# EAGLE board Open-Source_Control_Unitary_V2_R1 (EAGLE 9.3.0), part 1 of 2
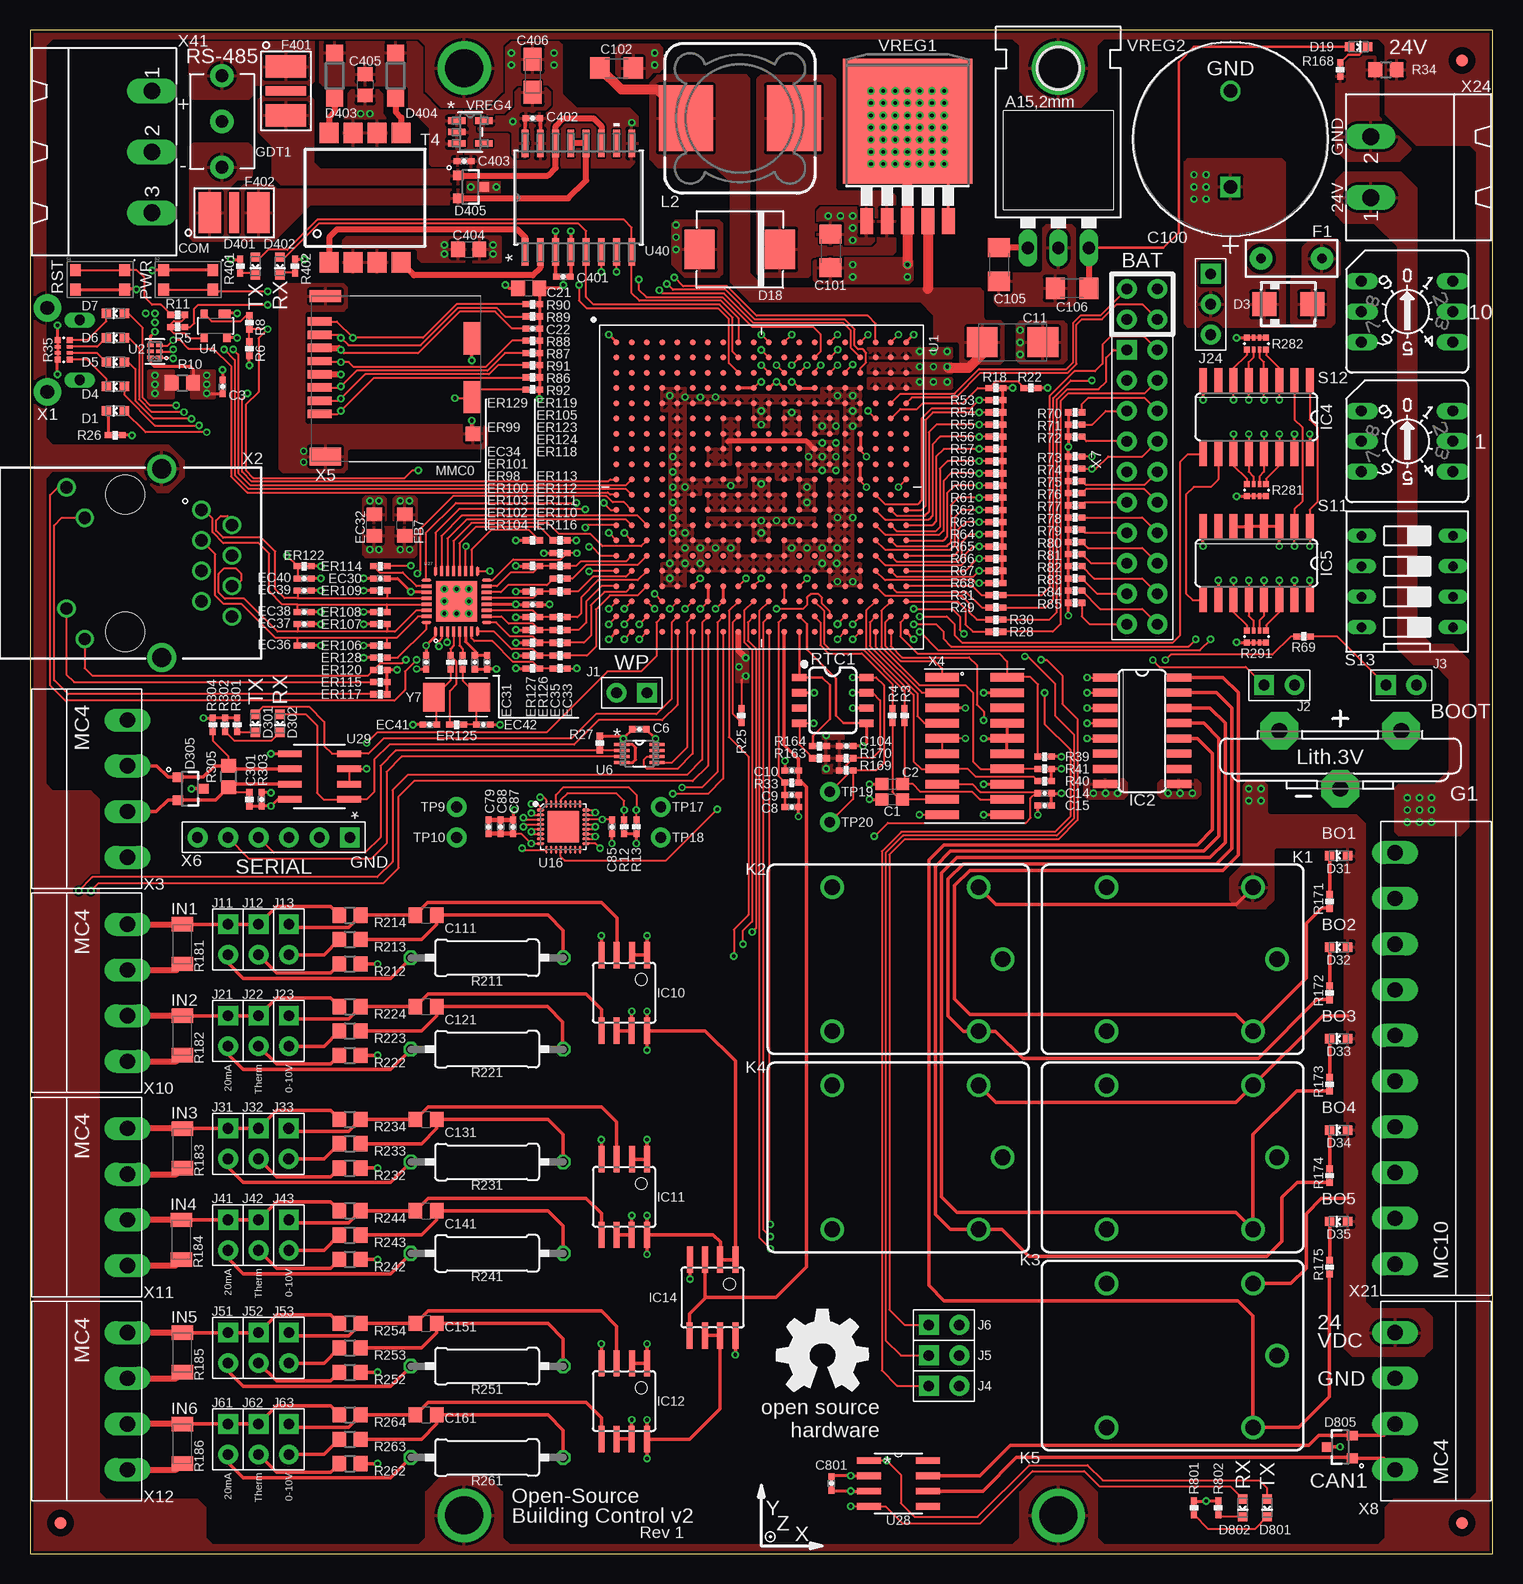
[diagram p7: board, top side]
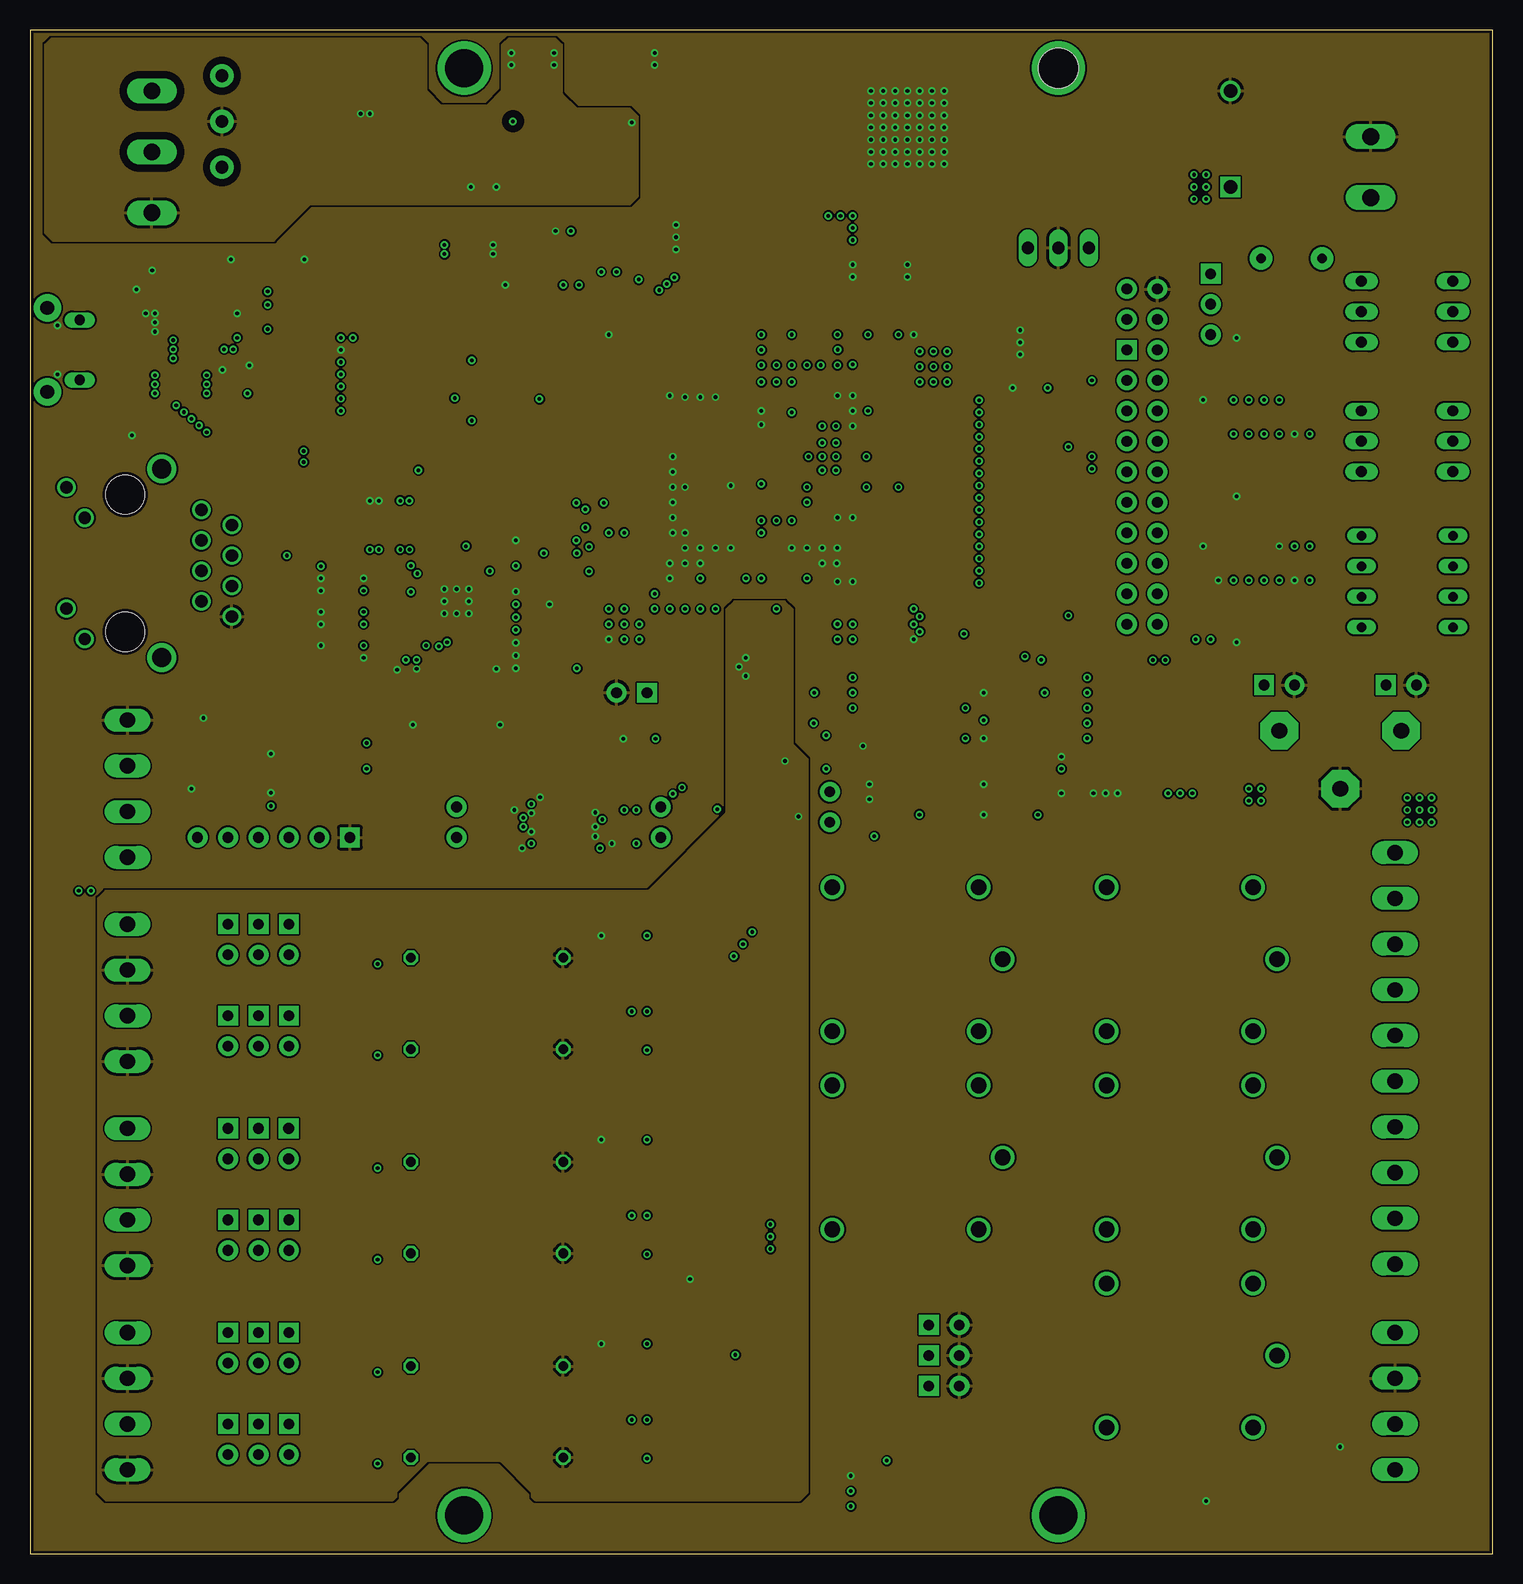
[diagram p8: board, inner layer Route2]
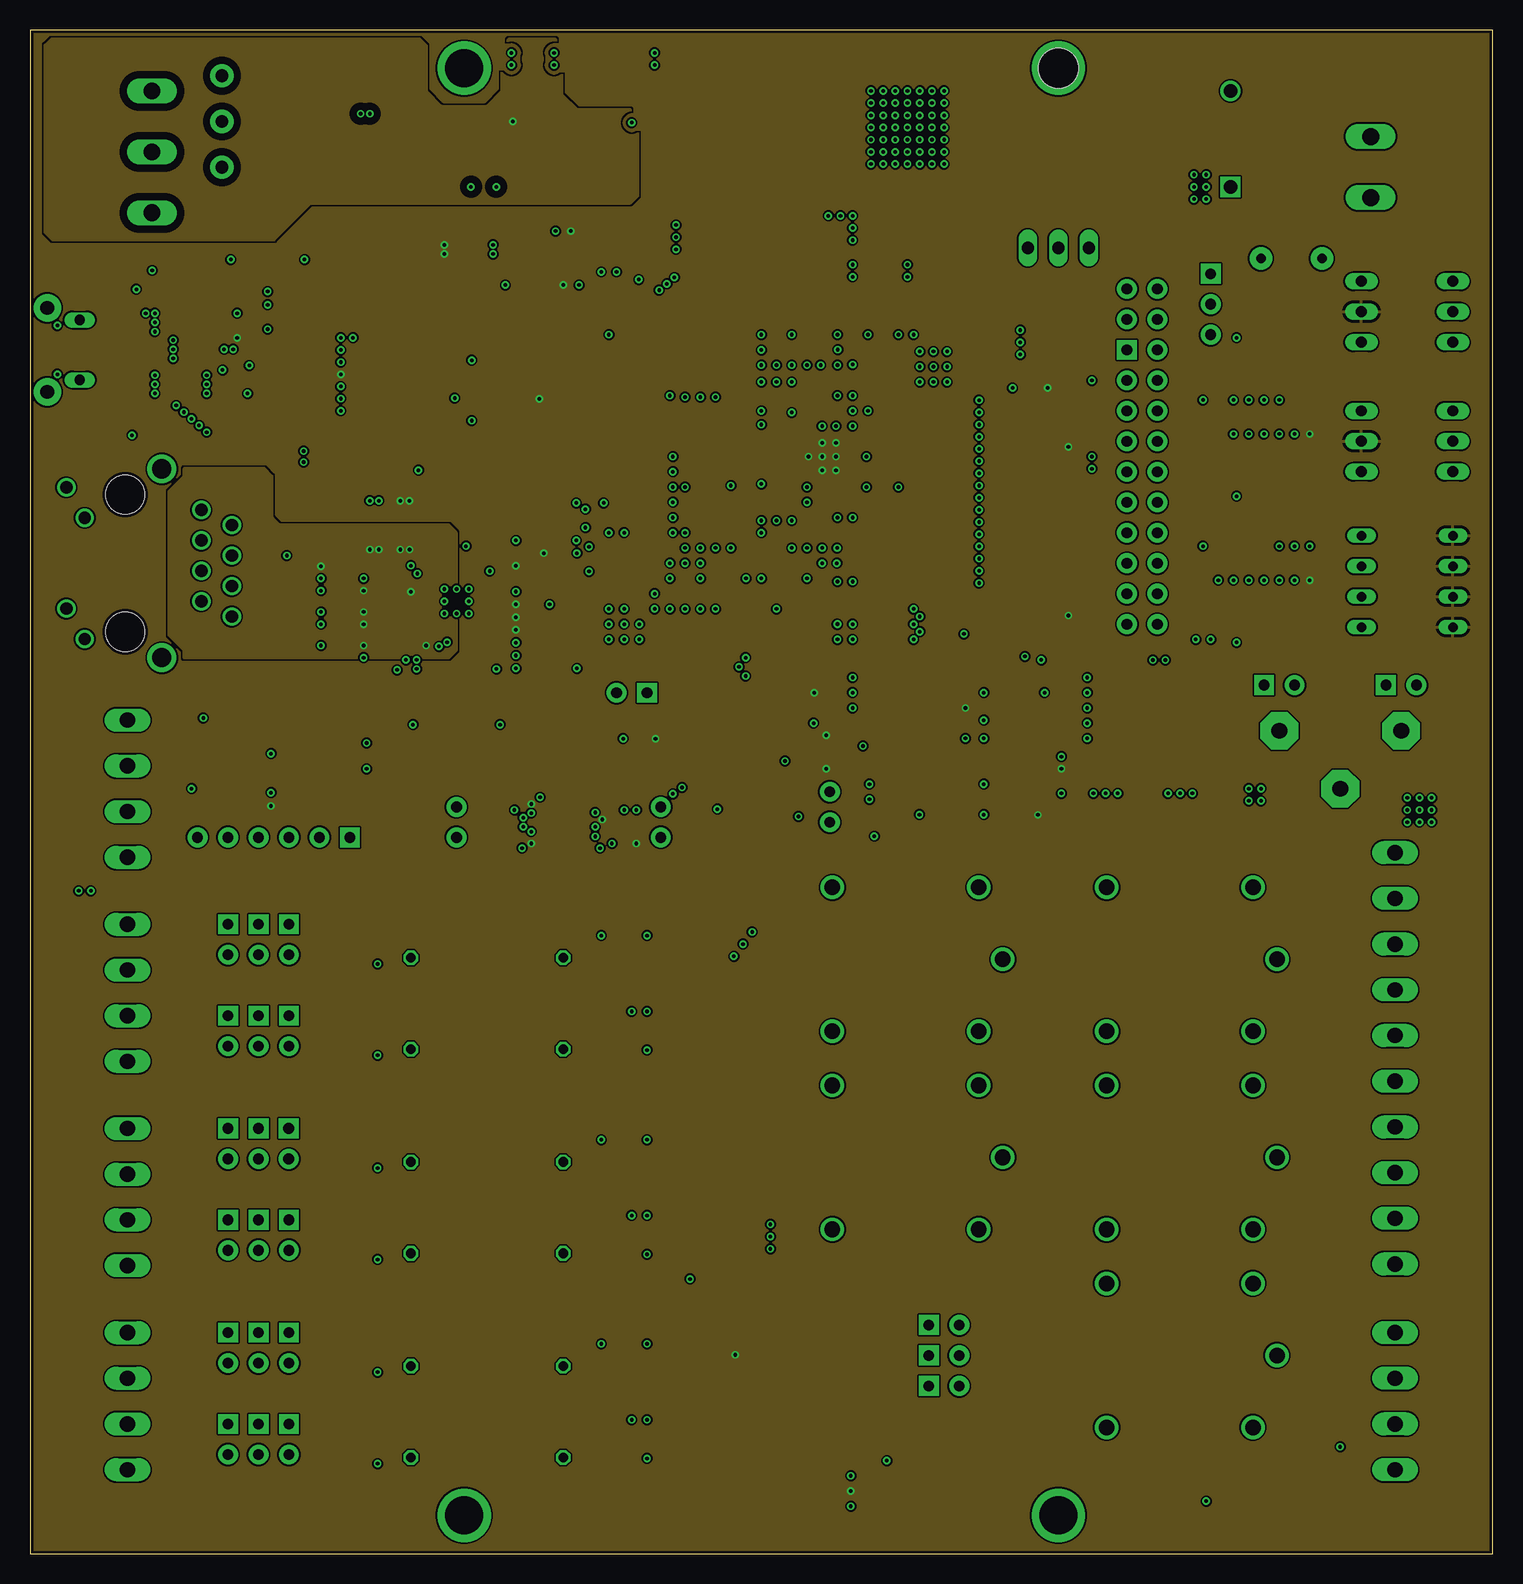
[diagram p9: board, inner layer Route15]
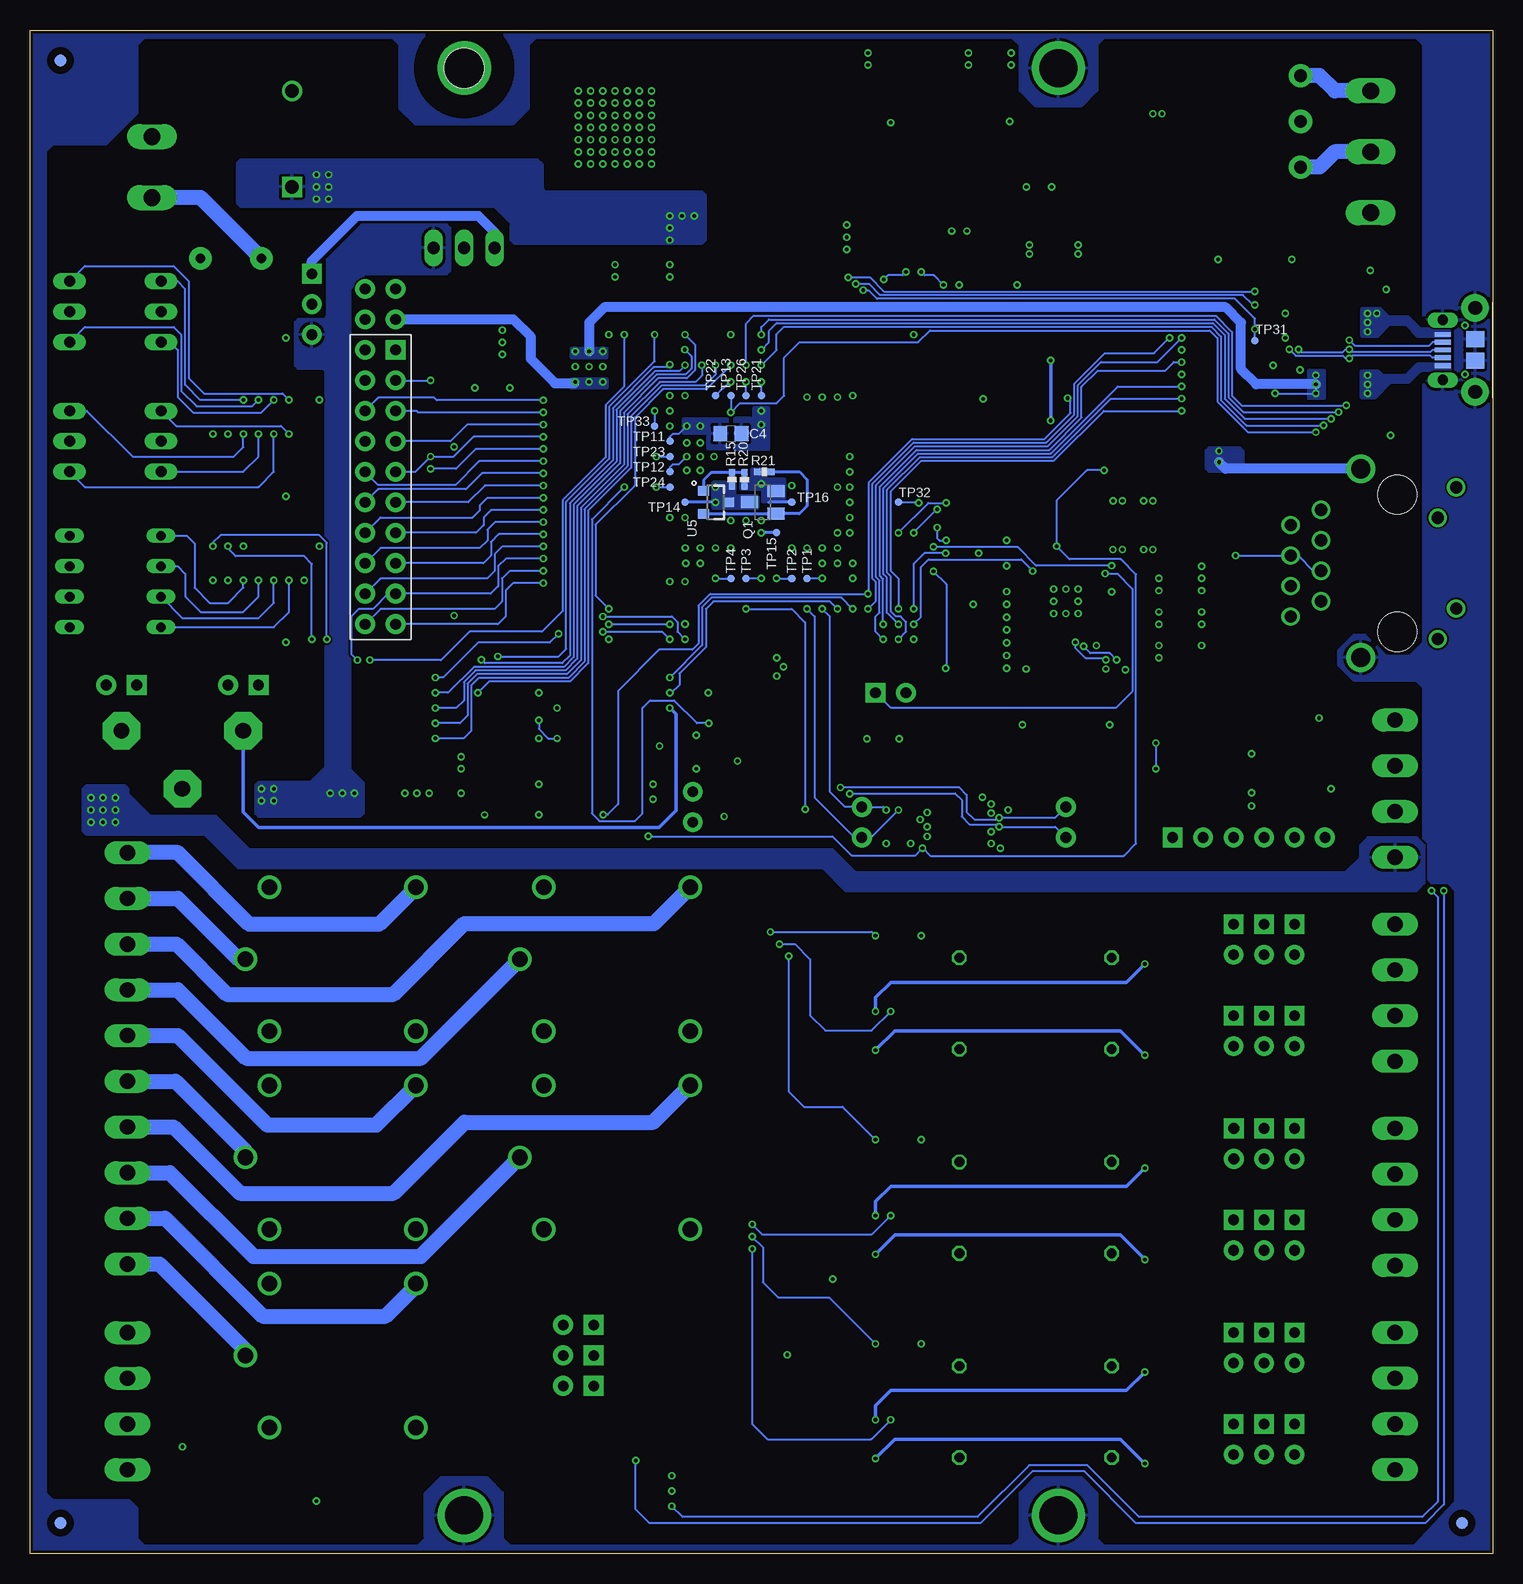
[diagram p10: board, bottom side, seen from below]

Size 121.92 x 127 mm. Coordinates in mm from the lower left corner, seen from the top.
Outline: 0,0 121.92,0 121.92,127 0,127 0,0
Copper layers (1*2*15*16): Top 0.035mm / dielectric 0.23mm / Route2 0.035mm / dielectric 0.93mm / Route15 0.035mm / dielectric 0.23mm / Bottom 0.035mm
Design rules "MF_Standard_4_Layer *": minimum track width 6mil, minimum drill 12mil, track to track 6mil, track to pad 6mil, pad to pad 6mil, via to via 6mil, smd to smd 0mil, copper to edge 10mil, drill to drill 10mil, minimum pad ring 6mil, minimum via ring 6mil, stop-mask expansion 2mil, vias tented up to drill 25mil, thermal gap 10mil
Net classes: 0 default: width 0.127 mm, drill 0.254 mm; 1 ground: width 0.152 mm, drill 0.254 mm, clearance 0.152 mm

## Footprints (pad centres in the part's own frame; a part is rotated, then mirrored left to right if it is on the bottom)
C0603 = smd 1.1 x 1: 1 -0.85,0; 2 0.85,0
C0402 = smd 0.61 x 0.508: 1 -0.559,0; 2 0.559,0
C0805 = smd 1.143 x 1.27: 1 -0.889,0; 2 0.889,0
C/6032-28R = smd 2.55 x 2.5: + 2.525,0; - -2.525,0
PCAP_16X25-THRU-ELECT = drill 1.118 pad 1.524 square: 1 -8.001,0 | drill 1.118 pad 1.524: 2 0,0
1206 = smd 1.6 x 1.8: 1 -1.4,0; 2 1.4,0
A/3216-18R = smd 1.95 x 1.5: + 1.375,0; - -1.375,0
EIA-STD = smd 0.787 x 0.787: 1 -0.749,0; 2 0.749,0
SMA = smd 2 x 2: A 2,0; C -2,0
SMC = smd 2.5 x 3.3: A 3.35,0; C -3.35,0
SOT23-3 = smd 0.8 x 0.9: 1 -0.95,-1; 2 0.95,-1; 3 0,1.1
SOD123 = smd 1.4 x 1.4: A 1.9,0; C -1.9,0
R0402 = smd 0.61 x 0.508: 1 -0.559,0; 2 0.559,0
PTH = drill 0.8 pad 1.88: P$1 -2.54,0; P$2 2.54,0
TBU-CA = smd 1.88 x 3.404: 1 -2.032,0; 3 2.032,0 | smd 0.813 x 3.404: 2 0,0
FIDUCIAL_40MIL = smd 1.016 x 1.016: P$1 0,0
CR2032V = drill 1.321 pad 3.15 octagon: + -2.54,-5.08; +@1 -2.54,5.08; - 2.286,0
2036-XX-B3 = drill 1.067 pad 1.93: 1 0,-3.81; 2 0,3.81; 3 0,0
SO16 = smd 0.66 x 2.032: 1 -4.445,-3.073; 2 -3.175,-3.073; 3 -1.905,-3.073; 4 -0.635,-3.073; 5 0.635,-3.073; 6 1.905,-3.073; 7 3.175,-3.073; 8 4.445,-3.073; 9 4.445,3.073; 10 3.175,3.073; 11 1.905,3.073; 12 0.635,3.073; 13 -0.635,3.073; 14 -1.905,3.073; 15 -3.175,3.073; 16 -4.445,3.073
SOIC8 = smd 0.5 x 2.2: 1 -1.905,-3.154; 2 -0.645,-3.154; 3 0.625,-3.154; 4 1.895,-3.154; 5 1.905,3.154; 6 0.635,3.154; 7 -0.635,3.154; 8 -1.905,3.154
H2-2.54 = drill 0.889 pad 1.651 square: 1 0,1.27 | drill 0.889 pad 1.651: 2 0,-1.27
H3-2.54 = drill 0.889 pad 1.651 square: 1 0,2.54 | drill 0.889 pad 1.651: 2 0,0; 3 0,-2.54
JS-M = drill 1.3: 1 6.7,6; 2 6.7,-6; C 8.7,0; NC -5.5,-6; NO -5.5,6
MSS1260 = smd 5.5 x 4.5: 1 0,4.5; 2 0,-4.5
MOUNTING_HOLE = drill 3.175 pad 4.445: P$1 0,0
SOT23-BEC = smd 1 x 1.4: B -0.95,-1.1; C 0,1.1; E 0.95,-1.1
R0805 = smd 1.143 x 1.27: 1 -0.889,0; 2 0.889,0
RN0804 = smd 0.498 x 0.5: 1 -0.801,-0.5; 4 0.801,-0.5; 5 0.801,0.5; 8 -0.801,0.5 | smd 0.3 x 0.5: 2 -0.25,-0.5; 3 0.25,-0.5; 6 0.25,0.5; 7 -0.25,0.5
CT/CN1206 = smd 1.2 x 1.8: 1 -1.65,0; 2 1.65,0
0309/12 = drill 0.813 octagon: 1 -6.35,0; 2 6.35,0
SO08 = smd 0.6 x 1.2: 1 -1.905,-2.8; 2 -0.635,-2.8; 3 0.635,-2.8; 4 1.905,-2.8; 5 1.905,2.8; 6 0.635,2.8; 7 -0.635,2.8; 8 -1.905,2.8
SW4SMD_63X161LS = smd 0.9 x 1: 1 2.05,0.8; 2 2.05,-0.8; 3 -2.05,0.8; 4 -2.05,-0.8
P101 = drill 0.914 long: 1 3.81,-2.54; 2 -3.81,2.54; 4 3.81,2.54; 8 -3.81,-2.54; C 3.81,0; C1 -3.81,0
DS-04 = drill 0.813 long: 1 -3.81,-3.81; 2 -1.27,-3.81; 3 1.27,-3.81; 4 3.81,-3.81; 5 3.81,3.81; 6 1.27,3.81; 7 -1.27,3.81; 8 -3.81,3.81
DA230X-AL = smd 1.7 x 1.6: P$1 -5.4,3; P$2 -5.4,1; P$3 -5.4,-1; P$4 -5.4,-3; P$5 5.4,-3; P$6 5.4,-1; P$7 5.4,1; P$8 5.4,3
TP_B0,65 = smd 0.635 x 0.635: TP 0,0
TESTPAD/W_HOLE_1X1 = drill 0.889 pad 1.651: P$1 0,0
OSD335X-BGA-400 = smd 0.5 x 0.5: A1 -12.065,-12.065; A2 -12.065,-10.795; A3 -12.065,-9.525; A4 -12.065,-8.255; A5 -12.065,-6.985; A6 -12.065,-5.715; A7 -12.065,-4.445; A8 -12.065,-3.175; A9 -12.065,-1.905; A10 -12.065,-0.635; A11 -12.065,0.635; A12 -12.065,1.905; A13 -12.065,3.175; A14 -12.065,4.445; A15 -12.065,5.715; A16 -12.065,6.985; A17 -12.065,8.255; A18 -12.065,9.525; A19 -12.065,10.795; A20 -12.065,12.065; B1 -10.795,-12.065; B2 -10.795,-10.795; B3 -10.795,-9.525; B4 -10.795,-8.255; B5 -10.795,-6.985; B6 -10.795,-5.715; B7 -10.795,-4.445; B8 -10.795,-3.175; B9 -10.795,-1.905; B10 -10.795,-0.635; B11 -10.795,0.635; B12 -10.795,1.905; B13 -10.795,3.175; B14 -10.795,4.445; B15 -10.795,5.715; B16 -10.795,6.985; B17 -10.795,8.255; B18 -10.795,9.525; B19 -10.795,10.795; B20 -10.795,12.065; C1 -9.525,-12.065; C2 -9.525,-10.795; C3 -9.525,-9.525; C4 -9.525,-8.255; C5 -9.525,-6.985; C6 -9.525,-5.715; C7 -9.525,-4.445; C8 -9.525,-3.175; C9 -9.525,-1.905; C10 -9.525,-0.635; C11 -9.525,0.635; C12 -9.525,1.905; C13 -9.525,3.175; C14 -9.525,4.445; C15 -9.525,5.715; C16 -9.525,6.985; C17 -9.525,8.255; C18 -9.525,9.525; C19 -9.525,10.795; C20 -9.525,12.065; D1 -8.255,-12.065; D2 -8.255,-10.795; D3 -8.255,-9.525; D4 -8.255,-8.255; D5 -8.255,-6.985; D6 -8.255,-5.715; D7 -8.255,-4.445; D8 -8.255,-3.175; D9 -8.255,-1.905; D10 -8.255,-0.635; D11 -8.255,0.635; D12 -8.255,1.905; D13 -8.255,3.175; D14 -8.255,4.445; D15 -8.255,5.715; D16 -8.255,6.985; D17 -8.255,8.255; D18 -8.255,9.525; D19 -8.255,10.795; D20 -8.255,12.065; E1 -6.985,-12.065; E2 -6.985,-10.795; E3 -6.985,-9.525; E4 -6.985,-8.255; E5 -6.985,-6.985; E6 -6.985,-5.715; E7 -6.985,-4.445; E8 -6.985,-3.175; E9 -6.985,-1.905; E10 -6.985,-0.635; E11 -6.985,0.635; E12 -6.985,1.905; E13 -6.985,3.175; E14 -6.985,4.445; E15 -6.985,5.715; E16 -6.985,6.985; E17 -6.985,8.255; E18 -6.985,9.525; E19 -6.985,10.795; E20 -6.985,12.065; F1 -5.715,-12.065; F2 -5.715,-10.795; F3 -5.715,-9.525; F4 -5.715,-8.255; F5 -5.715,-6.985; F6 -5.715,-5.715; F7 -5.715,-4.445; F8 -5.715,-3.175; F9 -5.715,-1.905; F10 -5.715,-0.635; F11 -5.715,0.635; F12 -5.715,1.905; F13 -5.715,3.175; F14 -5.715,4.445; F15 -5.715,5.715; F16 -5.715,6.985; F17 -5.715,8.255; F18 -5.715,9.525; F19 -5.715,10.795; F20 -5.715,12.065; G1 -4.445,-12.065; G2 -4.445,-10.795; G3 -4.445,-9.525; G4 -4.445,-8.255; G5 -4.445,-6.985; G6 -4.445,-5.715; G7 -4.445,-4.445; G8 -4.445,-3.175; G9 -4.445,-1.905; G10 -4.445,-0.635; G11 -4.445,0.635; G12 -4.445,1.905; G13 -4.445,3.175; G14 -4.445,4.445; G15 -4.445,5.715; G16 -4.445,6.985; G17 -4.445,8.255; G18 -4.445,9.525; G19 -4.445,10.795; G20 -4.445,12.065; H1 -3.175,-12.065; H2 -3.175,-10.795; H3 -3.175,-9.525; H4 -3.175,-8.255; H5 -3.175,-6.985; H6 -3.175,-5.715; H7 -3.175,-4.445; H8 -3.175,-3.175; H9 -3.175,-1.905; H10 -3.175,-0.635; H11 -3.175,0.635; H12 -3.175,1.905; H13 -3.175,3.175; H14 -3.175,4.445; H15 -3.175,5.715; H16 -3.175,6.985; H17 -3.175,8.255; H18 -3.175,9.525; H19 -3.175,10.795; H20 -3.175,12.065; J1 -1.905,-12.065; J2 -1.905,-10.795; J3 -1.905,-9.525; J4 -1.905,-8.255; J5 -1.905,-6.985; J6 -1.905,-5.715; J7 -1.905,-4.445; J8 -1.905,-3.175; J9 -1.905,-1.905; J10 -1.905,-0.635; J11 -1.905,0.635; J12 -1.905,1.905; J13 -1.905,3.175; J14 -1.905,4.445; J15 -1.905,5.715; J16 -1.905,6.985; J17 -1.905,8.255; J18 -1.905,9.525; J19 -1.905,10.795; J20 -1.905,12.065; K1 -0.635,-12.065; K2 -0.635,-10.795; K3 -0.635,-9.525; K4 -0.635,-8.255; K5 -0.635,-6.985; K6 -0.635,-5.715; K7 -0.635,-4.445; K8 -0.635,-3.175; K9 -0.635,-1.905; K10 -0.635,-0.635; K11 -0.635,0.635; K12 -0.635,1.905; K13 -0.635,3.175; K14 -0.635,4.445; K15 -0.635,5.715; K16 -0.635,6.985; K17 -0.635,8.255; K18 -0.635,9.525; K19 -0.635,10.795; K20 -0.635,12.065; L1 0.635,-12.065; L2 0.635,-10.795; L3 0.635,-9.525; L4 0.635,-8.255; L5 0.635,-6.985; L6 0.635,-5.715; L7 0.635,-4.445; L8 0.635,-3.175; L9 0.635,-1.905; L10 0.635,-0.635; L11 0.635,0.635; L12 0.635,1.905; L13 0.635,3.175; L14 0.635,4.445; L15 0.635,5.715; L16 0.635,6.985; L17 0.635,8.255; L18 0.635,9.525; L19 0.635,10.795; L20 0.635,12.065; M1 1.905,-12.065; M2 1.905,-10.795; M3 1.905,-9.525; M4 1.905,-8.255; M5 1.905,-6.985; M6 1.905,-5.715; M7 1.905,-4.445; M8 1.905,-3.175; M9 1.905,-1.905; M10 1.905,-0.635; M11 1.905,0.635; M12 1.905,1.905; M13 1.905,3.175; M14 1.905,4.445; M15 1.905,5.715; M16 1.905,6.985; M17 1.905,8.255; M18 1.905,9.525; M19 1.905,10.795; M20 1.905,12.065; N1 3.175,-12.065; N2 3.175,-10.795; N3 3.175,-9.525; N4 3.175,-8.255; N5 3.175,-6.985; N6 3.175,-5.715; N7 3.175,-4.445; N8 3.175,-3.175; N9 3.175,-1.905; N10 3.175,-0.635; N11 3.175,0.635; N12 3.175,1.905; N13 3.175,3.175; N14 3.175,4.445; N15 3.175,5.715; N16 3.175,6.985; N17 3.175,8.255; N18 3.175,9.525; N19 3.175,10.795; N20 3.175,12.065; P1 4.445,-12.065; P2 4.445,-10.795; P3 4.445,-9.525; P4 4.445,-8.255; P5 4.445,-6.985; P6 4.445,-5.715; P7 4.445,-4.445; P8 4.445,-3.175; P9 4.445,-1.905; P10 4.445,-0.635; P11 4.445,0.635; P12 4.445,1.905; P13 4.445,3.175; P14 4.445,4.445; P15 4.445,5.715; P16 4.445,6.985; P17 4.445,8.255; P18 4.445,9.525; P19 4.445,10.795; P20 4.445,12.065; R1 5.715,-12.065; R2 5.715,-10.795; R3 5.715,-9.525; R4 5.715,-8.255; R5 5.715,-6.985; R6 5.715,-5.715; R7 5.715,-4.445; R8 5.715,-3.175; R9 5.715,-1.905; R10 5.715,-0.635; R11 5.715,0.635; R12 5.715,1.905; R13 5.715,3.175; R14 5.715,4.445; R15 5.715,5.715; R16 5.715,6.985; R17 5.715,8.255; R18 5.715,9.525; R19 5.715,10.795; R20 5.715,12.065; T1 6.985,-12.065; T2 6.985,-10.795; T3 6.985,-9.525; T4 6.985,-8.255; T5 6.985,-6.985; T6 6.985,-5.715; T7 6.985,-4.445; T8 6.985,-3.175; T9 6.985,-1.905; T10 6.985,-0.635; T11 6.985,0.635; T12 6.985,1.905; T13 6.985,3.175; T14 6.985,4.445; T15 6.985,5.715; T16 6.985,6.985; T17 6.985,8.255; T18 6.985,9.525; T19 6.985,10.795; T20 6.985,12.065; U1 8.255,-12.065; U2 8.255,-10.795; U3 8.255,-9.525; U4 8.255,-8.255; U5 8.255,-6.985; U6 8.255,-5.715; U7 8.255,-4.445; U8 8.255,-3.175; U9 8.255,-1.905; U10 8.255,-0.635; U11 8.255,0.635; U12 8.255,1.905; U13 8.255,3.175; U14 8.255,4.445; U15 8.255,5.715; U16 8.255,6.985; U17 8.255,8.255; U18 8.255,9.525; U19 8.255,10.795; U20 8.255,12.065; V1 9.525,-12.065; V2 9.525,-10.795; V3 9.525,-9.525; V4 9.525,-8.255; V5 9.525,-6.985; V6 9.525,-5.715; V7 9.525,-4.445; V8 9.525,-3.175; V9 9.525,-1.905; V10 9.525,-0.635; V11 9.525,0.635; V12 9.525,1.905; V13 9.525,3.175; V14 9.525,4.445; V15 9.525,5.715; V16 9.525,6.985; V17 9.525,8.255; V18 9.525,9.525; V19 9.525,10.795; V20 9.525,12.065; W1 10.795,-12.065; W2 10.795,-10.795; W3 10.795,-9.525; W4 10.795,-8.255; W5 10.795,-6.985; W6 10.795,-5.715; W7 10.795,-4.445; W8 10.795,-3.175; W9 10.795,-1.905; W10 10.795,-0.635; W11 10.795,0.635; W12 10.795,1.905; W13 10.795,3.175; W14 10.795,4.445; W15 10.795,5.715; W16 10.795,6.985; W17 10.795,8.255; W18 10.795,9.525; W19 10.795,10.795; W20 10.795,12.065; Y1 12.065,-12.065; Y2 12.065,-10.795; Y3 12.065,-9.525; Y4 12.065,-8.255; Y5 12.065,-6.985; Y6 12.065,-5.715; Y7 12.065,-4.445; Y8 12.065,-3.175; Y9 12.065,-1.905; Y10 12.065,-0.635; Y11 12.065,0.635; Y12 12.065,1.905; Y13 12.065,3.175; Y14 12.065,4.445; Y15 12.065,5.715; Y16 12.065,6.985; Y17 12.065,8.255; Y18 12.065,9.525; Y19 12.065,10.795; Y20 12.065,12.065
DRY6 = smd 0.55 x 0.3: 1 -0.355,0.5 | smd 0.52 x 0.3: 2 -0.37,0; 3 -0.37,-0.5; 4 0.37,-0.5; 5 0.37,0; 6 0.37,0.5
SOT143-R = smd 1 x 0.7: 1 -0.75,-1 | smd 0.6 x 0.7: 2 0.95,-1; 3 0.95,1; 4 -0.95,1
DCU8 = smd 1.27 x 0.254: 1 -1.473,0.749; 2 -1.473,0.249; 3 -1.473,-0.249; 4 -1.473,-0.749; 5 1.473,-0.749; 6 1.473,-0.249; 7 1.473,0.249; 8 1.473,0.749
QFN32-0.4-4X4MM = smd 0.6 x 0.2: 1 -1.9,1.4; 2 -1.9,1; 3 -1.9,0.6; 4 -1.9,0.2; 5 -1.9,-0.2; 6 -1.9,-0.6; 7 -1.9,-1; 8 -1.9,-1.4; 17 1.9,-1.4; 18 1.9,-1; 19 1.9,-0.6; 20 1.9,-0.2; 21 1.9,0.2; 22 1.9,0.6; 23 1.9,1; 24 1.9,1.4 | smd 0.2 x 0.6: 9 -1.4,-1.9; 10 -1,-1.9; 11 -0.6,-1.9; 12 -0.2,-1.9; 13 0.2,-1.9; 14 0.6,-1.9; 15 1,-1.9; 16 1.4,-1.9; 25 1.4,1.9; 26 1,1.9; 27 0.6,1.9; 28 0.2,1.9; 29 -0.2,1.9; 30 -0.6,1.9; 31 -1,1.9; 32 -1.4,1.9 | smd 2.7 x 2.7: 33 0,0
LAN8710A-QFN32 = smd 0.254 x 0.838: 1 -1.751,-2.515; 2 -1.251,-2.515; 3 -0.751,-2.515; 4 -0.251,-2.515; 5 0.251,-2.515; 6 0.751,-2.515; 7 1.251,-2.515; 8 1.751,-2.515; 17 1.751,2.515; 18 1.251,2.515; 19 0.751,2.515; 20 0.251,2.515; 21 -0.251,2.515; 22 -0.751,2.515; 23 -1.251,2.515; 24 -1.751,2.515 | smd 0.838 x 0.254: 9 2.515,-1.751; 10 2.515,-1.251; 11 2.515,-0.751; 12 2.515,-0.251; 13 2.515,0.251; 14 2.515,0.751; 15 2.515,1.251; 16 2.515,1.751; 25 -2.515,1.751; 26 -2.515,1.251; 27 -2.515,0.751; 28 -2.515,0.251; 29 -2.515,-0.251; 30 -2.515,-0.751; 31 -2.515,-1.251; 32 -2.515,-1.751 | smd 3.404 x 3.404: 33 0,0
BEAGLEBONE_BLUE_D8 = smd 1.981 x 0.559: 1 -2.464,1.905; 2 -2.464,0.635; 3 -2.464,-0.635; 4 -2.464,-1.905; 5 2.464,-1.905; 6 2.464,-0.635; 7 2.464,0.635; 8 2.464,1.905
21-0041B_8 = smd 1.981 x 0.533: 1 -2.464,1.905; 2 -2.464,0.635; 3 -2.464,-0.635; 4 -2.464,-1.905; 5 2.464,-1.905; 6 2.464,-0.635; 7 2.464,0.635; 8 2.464,1.905
DW16 = smd 2.311 x 0.559: 1 -4.521,4.445; 2 -4.521,3.175; 3 -4.521,1.905; 4 -4.521,0.635; 5 -4.521,-0.635; 6 -4.521,-1.905; 7 -4.521,-3.175; 8 -4.521,-4.445; 9 4.521,-4.445; 10 4.521,-3.175; 11 4.521,-1.905; 12 4.521,-0.635; 13 4.521,0.635; 14 4.521,1.905; 15 4.521,3.175; 16 4.521,4.445
TO263-5 = smd 1.067 x 2.159: 1 -3.404,-5.791; 2 -1.702,-5.791; 3 0,-5.791; 4 1.702,-5.791; 5 3.404,-5.791 | smd 10.8 x 10.41: 6 0,2.54
78XXL = drill 1.016 long: GND 0,-3.81; IN -2.54,-3.81; OUT 2.54,-3.81 | hole 3.302: 0,11.176
DBV5 = smd 1.473 x 0.559: 1 -1.118,0.95; 2 -1.118,0; 3 -1.118,-0.95; 4 1.118,-0.95; 5 1.118,0.95
10118194-0001LF(MICRO-USB-B-AMPHENOL-FCI) = drill 1.15 pad 2.286: CGND1 0,3.5; CGND4 0,-3.5 | smd 1.5 x 1.35: CGND2 0,0.9; CGND3 0,-0.9 | drill 0.85 long: CGND5 2.7,-2.5; CGND6 2.7,2.5 | smd 1.35 x 0.4: D+ 2.7,0; D- 2.7,0.65; GND 2.7,-1.3; ID 2.7,-0.65; VBUS 2.7,1.3
J0011D01BNL = drill 1.016 pad 1.524: 1 4.445,-6.413; 2 3.175,-8.954; 3 1.905,-6.413; 4 0.635,-8.954; 5 -0.635,-6.413; 6 -1.905,-8.954; 7 -3.175,-6.413; 8 -4.445,-8.954; 9 6.325,4.839; 10 3.785,3.315; 11 -3.785,4.839; 12 -6.325,3.315 | drill 1.6 pad 2.286: S1 -7.874,-3.111; S2 7.874,-3.111 | hole 3.251: -5.715,-0.064; 5.715,-0.064
MC4 = drill 1.27 long: 1 -5.715,0; 2 -1.905,0; 3 1.905,0; 4 5.715,0
CTI-JTAG = smd 2.794 x 0.711: 1 -2.705,5.715; 2 2.705,5.715; 3 -2.705,4.445; 4 2.705,4.445; 5 -2.705,3.175; 6 2.705,3.175; 7 -2.705,1.905; 8 2.705,1.905; 9 -2.705,0.635; 10 2.705,0.635; 11 -2.705,-0.635; 12 2.705,-0.635; 13 -2.705,-1.905; 14 2.705,-1.905; 15 -2.705,-3.175; 16 2.705,-3.175; 17 -2.705,-4.445; 18 2.705,-4.445; 19 -2.705,-5.715; 20 2.705,-5.715
DM3CS-SF = smd 0.7 x 2: 1 0,0; 2 -1.1,0; 3 -2.2,0; 4 -3.3,0; 5 -4.4,0; 6 -5.5,0; 7 -6.6,0; 8 -7.7,0 | smd 1 x 2.6: 9 -9.8,0.5 | smd 1.5 x 2.6: 10 3.55,0.5 | smd 1.2 x 1.2: 11 1.65,12.8 | smd 2.7 x 1.4: 12 -1.4,12.7; 13 -6.3,12.7
H6-2.54 = drill 0.889 pad 1.651 square: 1 0,6.35 | drill 0.889 pad 1.651: 2 0,3.81; 3 0,1.27; 4 0,-1.27; 5 0,-3.81; 6 0,-6.35
H2X10-2.54 = drill 0.889 pad 1.651 square: 1 -1.27,11.43 | drill 0.889 pad 1.651: 2 1.27,11.43; 3 -1.27,8.89; 4 1.27,8.89; 5 -1.27,6.35; 6 1.27,6.35; 7 -1.27,3.81; 8 1.27,3.81; 9 -1.27,1.27; 10 1.27,1.27; 11 -1.27,-1.27; 12 1.27,-1.27; 13 -1.27,-3.81; 14 1.27,-3.81; 15 -1.27,-6.35; 16 1.27,-6.35; 17 -1.27,-8.89; 18 1.27,-8.89; 19 -1.27,-11.43; 20 1.27,-11.43
MC10 = drill 1.27 long: 1 -17.145,0; 2 -13.335,0; 3 -9.525,0; 4 -5.715,0; 5 -1.905,0; 6 1.905,0; 7 5.715,0; 8 9.525,0; 9 13.335,0; 10 17.145,0
MSTBA2 = drill 1.397 long: 1 -2.54,5.08; 2 2.54,5.08
MSTBA3 = drill 1.397 long: 1 -5.08,5.08; 2 0,5.08; 3 5.08,5.08
CRYSTAL-TXC-7A = smd 1.788 x 2.413: P$1 1.9,0; P$2 -1.9,0

## Placement (x,y rotation side)
C1  DNI  [C0603]  71.88,62.87 0 top
C2  DNI  [C0603]  71.88,64.14 0 top
C3  0.1uF, 6.3V  [C0402]  16.05,97.26 90 top
C4  47uF  [C0805]  63.5,93.34 0 bottom
C6  0.1uF, 6.3V  [C0402]  50.8,68.71 0 top
C8  1nF  [C0402]  63.5,62.23 0 top
C9  0.1uF, 6.3V  [C0402]  63.5,63.25 0 top
C10  0.1uF, 6.3V  [C0402]  63.5,65.28 180 top
C11  220uF, 6.3V, T491C227K006AT  [C/6032-28R]  81.92,100.97 180 top
C14  0.1uF, 6.3V  [C0402]  84.58,63.37 0 top
C15  0.1uF, 6.3V  [C0402]  84.58,62.36 0 top
C21  10uF, 10V  [C0805]  41.58,105.46 180 top
C22  0.1uF, 6.3V  [C0402]  41.91,102.11 180 top
C79  0.1uF, 6.3V  [C0402]  38.23,60.58 90 top
C85  2200pF, 6.3V  [C0402]  48.51,60.58 270 top
C87  2200pF, 6.3V  [C0402]  40.26,60.58 90 top
C88  2200pF, 6.3V  [C0402]  39.24,60.58 90 top
C100  1000uF, 50V, UHE1H102MHD6  [PCAP_16X25-THRU-ELECT]  100.08,121.92 90 top
C101  0.47uF, 100V, X7R  [1206]  66.73,108.58 270 top
C102  0.47uF, 100V, X7R  [1206]  48.9,123.83 0 top
C104  0.1uF, 6.3V  [C0402]  68.05,67.31 0 top
C105  0.47uF, 100V, X7R  [1206]  80.77,107.44 270 top
C106  0.1uF, 50V  [1206]  86.87,105.46 180 top
C111  1uF  [C0805]  33.02,53.21 0 top
C121  1uF  [C0805]  33.02,45.59 0 top
C131  1uF  [C0805]  33.02,36.2 0 top
C141  1uF  [C0805]  33.02,28.57 0 top
C151  1uF  [C0805]  33.02,19.18 0 top
C161  1uF  [C0805]  33.02,11.56 0 top
C301  0.1uF, 6.3V  [C0402]  19.3,62.87 90 top
C401  0.1uF, 16V  [C0402]  44.45,106.43 180 top
C402  0.1uF, 16V  [C0402]  41.91,119.63 0 top
C403  0.1uF, 16V  [C0402]  36.2,116.08 0 top
C404  10uF, 16V  [C0805]  36.58,108.71 0 top
C405  10uF, 16V  [C0805]  27.94,122.43 270 top
C406  4.7uF, 16V, T491A475K016AT  [A/3216-18R]  41.91,123.19 270 top
C801  0.1uF, 6.3V  [C0402]  66.8,5.84 90 top
D1  LTST-C191KFKT  [EIA-STD]  7.11,95.25 180 top
D3  S1D  [SMA]  104.88,104.14 0 top
D4  LTST-C191KGKT  [EIA-STD]  7.11,97.28 180 top
D5  LTST-C191KGKT  [EIA-STD]  7.11,99.31 180 top
D6  LTST-C191KGKT  [EIA-STD]  7.11,101.35 180 top
D7  LTST-C191KGKT  [EIA-STD]  7.11,103.38 180 top
D18  B550C-13-F  [SMC]  59.18,108.71 180 top
D19  LTST-C191KRKT  [EIA-STD]  110.74,125.6 0 top
D31  LTST-C191KRKT  [EIA-STD]  109.09,58.17 180 top
D32  LTST-C191KRKT  [EIA-STD]  109.09,50.55 180 top
D33  LTST-C191KRKT  [EIA-STD]  109.09,42.93 180 top
D34  LTST-C191KRKT  [EIA-STD]  109.09,35.31 180 top
D35  LTST-C191KRKT  [EIA-STD]  109.09,27.69 180 top
D301  LTST-C191KGKT  [EIA-STD]  18.8,69.22 270 top
D302  LTST-C191KFKT  [EIA-STD]  20.83,69.22 270 top
D305  SM712  [SOT23-3]  13.34,63.75 270 top
D401  LTST-C191KGKT  [EIA-STD]  18.8,107.31 270 top
D402  LTST-C191KFKT  [EIA-STD]  20.83,107.31 270 top
D403  MBR0520LT  [SOD123]  25.4,123.19 270 top
D404  MBR0520LT  [SOD123]  30.48,123.19 270 top
D405  SM712  [SOT23-3]  36.7,113.92 270 top
D801  LTST-C191KFKT  [EIA-STD]  103.12,3.81 270 top
D802  LTST-C191KGKT  [EIA-STD]  101.09,3.81 270 top
D805  CDSOT23-T24CAN  [SOT23-3]  109.22,8.89 90 top
EC30  0.1uF, 6.3V  [C0402]  29.21,81.28 180 top
EC31  0.1uF, 6.3V  [C0402]  33.02,74.3 270 top
EC32  10uF, 10V  [C0805]  28.7,85.72 90 top
EC33  1uF, 10V  [C0402]  38.1,74.3 270 top
EC34  0.1uF, 6.3V  [C0402]  41.91,79.12 0 top
EC35  470pF, 6.3V  [C0402]  37.08,74.3 270 top
EC36  15pF, DNI  [C0402]  22.86,75.69 0 top
EC37  15pF, DNI  [C0402]  22.86,77.47 0 top
EC38  15pF, DNI  [C0402]  22.86,78.49 0 top
EC39  15pF, DNI  [C0402]  22.86,80.26 0 top
EC40  0.022uF, 10V  [C0402]  22.86,81.28 0 top
EC41  30pF, 50V  [C0402]  33.32,69.09 180 top
EC42  30pF, 50V  [C0402]  37.8,69.09 0 top
ER98  1.5K, 1%  [R0402]  41.91,78.05 0 top
ER99  1.5K, 1%  [R0402]  41.91,82.32 0 top
ER100  1.5K, 1%  [R0402]  41.91,76.99 0 top
ER101  10K, 1%  [R0402]  41.91,80.19 180 top
ER102  10K, 1%  [R0402]  41.91,74.85 180 top
ER103  10K, 1%  [R0402]  41.91,75.92 180 top
ER104  10K, 1%  [R0402]  41.91,73.79 180 top
ER105  1.5K, 1%  [R0402]  44.2,83.39 0 top
ER106  49.9, 1%  [R0402]  29.21,75.69 0 top
ER107  49.9, 1%  [R0402]  29.21,77.47 0 top
ER108  49.9, 1%  [R0402]  29.21,78.49 0 top
ER109  49.9, 1%  [R0402]  29.21,80.26 0 top
ER110  100, 1%  [R0402]  44.2,74.85 0 top
ER111  100, 1%  [R0402]  44.2,75.92 0 top
ER112  100, 1%  [R0402]  44.2,76.99 0 top
ER113  100, 1%  [R0402]  44.2,78.05 0 top
ER114  100, 1%  [R0402]  29.21,82.3 0 top
ER115  470, 1%  [R0402]  29.21,72.64 180 top
ER116  100, 1%  [R0402]  44.2,73.79 0 top
ER117  470, 1%  [R0402]  29.21,71.63 180 top
ER118  100, 1%  [R0402]  44.2,80.19 0 top
ER119  100, 1%  [R0402]  44.2,84.45 0 top
ER120  10K, 1%  [R0402]  29.21,73.66 180 top
ER122  0, 1%  [R0402]  22.86,82.3 180 top
ER123  100, 1%  [R0402]  44.2,82.32 0 top
ER124  100, 1%  [R0402]  44.2,81.25 0 top
ER125  1M, 1%, DNI  [R0402]  35.56,69.09 0 top
ER126  0, 1%  [R0402]  36.07,74.3 270 top
ER127  10, 1%  [R0402]  35.05,74.3 270 top
ER128  12.1K, 1%  [R0402]  29.21,74.68 0 top
ER129  10K, 1%  [R0402]  41.91,84.45 180 top
F1  60V, 750mA, R075  [PTH]  105.16,107.95 0 top
F401  TBU-CA085-300-WH  [TBU-CA]  21.34,121.92 270 top
F402  TBU-CA085-300-WH  [TBU-CA]  17.02,111.76 0 top
FB7  150ohm, 800mA  [C0805]  31.24,85.72 270 top
FUD1  FIDUCIAL  [FIDUCIAL_40MIL]  119.38,2.54 0 top
FUD2  FIDUCIAL  [FIDUCIAL_40MIL]  119.38,124.46 0 top
FUD3  FIDUCIAL  [FIDUCIAL_40MIL]  2.54,2.54 0 top
FUD4  FIDUCIAL  [FIDUCIAL_40MIL]  119.38,124.46 90 bottom
FUD5  FIDUCIAL  [FIDUCIAL_40MIL]  2.54,2.54 90 bottom
FUD6  FIDUCIAL  [FIDUCIAL_40MIL]  119.38,2.54 90 bottom
G1  CR2032V  [CR2032V]  109.22,66.04 270 top
GDT1  2036-07-B3  [2036-XX-B3]  16,119.38 0 top
IC2  ULN2003AD  [SO16]  92.71,68.58 270 top
IC4  74HC165D  [SO16]  102.23,94.74 180 top
IC5  74HC165D  [SO16]  102.23,82.55 180 top
IC10  MCP6002SMT  [SOIC8]  49.53,46.74 180 top
IC11  MCP6002SMT  [SOIC8]  49.53,29.72 180 top
IC12  MCP6002SMT  [SOIC8]  49.53,12.7 180 top
IC14  MCP6002SMT  [SOIC8]  56.9,21.34 180 top
J1  [H2-2.54]  50.16,71.75 270 top
J2  [H2-2.54]  104.14,72.39 90 top
J3  [H2-2.54]  114.3,72.39 90 top
J4  [H2-2.54]  76.2,13.97 90 top
J5  [H2-2.54]  76.2,16.51 90 top
J6  [H2-2.54]  76.2,19.05 90 top
J11  [H2-2.54]  16.51,51.18 0 top
J12  [H2-2.54]  19.05,51.18 0 top
J13  [H2-2.54]  21.59,51.18 0 top
J21  [H2-2.54]  16.51,43.56 0 top
J22  [H2-2.54]  19.05,43.56 0 top
J23  [H2-2.54]  21.59,43.56 0 top
J24  6p-2.54  [H3-2.54]  98.42,104.14 0 top
J31  [H2-2.54]  16.51,34.16 0 top
J32  [H2-2.54]  19.05,34.16 0 top
J33  [H2-2.54]  21.56,34.16 0 top
J41  [H2-2.54]  16.51,26.54 0 top
J42  [H2-2.54]  19.05,26.54 0 top
J43  [H2-2.54]  21.59,26.54 0 top
J51  [H2-2.54]  16.51,17.14 0 top
J52  [H2-2.54]  19.05,17.14 0 top
J53  [H2-2.54]  21.59,17.14 0 top
J61  [H2-2.54]  16.51,9.53 0 top
J62  [H2-2.54]  19.05,9.53 0 top
J63  [H2-2.54]  21.59,9.53 0 top
K1  JS1-24V-F  [JS-M]  95.25,49.53 0 top
K2  JS1-24V-F  [JS-M]  72.39,49.53 0 top
K3  JS1-24V-F  [JS-M]  95.25,33.02 0 top
K4  JS1-24V-F  [JS-M]  72.39,33.02 0 top
K5  JS1-24V-F  [JS-M]  95.25,16.51 0 top
L2  MSS1260T-473ML  [MSS1260]  59.18,119.63 270 top
MGT1  MOUNTING_HOLE  [MOUNTING_HOLE]  36.2,3.17 0 top
MGT2  MOUNTING_HOLE  [MOUNTING_HOLE]  85.72,3.17 0 top
MGT3  MOUNTING_HOLE  [MOUNTING_HOLE]  36.2,123.83 0 top
MGT4  MOUNTING_HOLE  [MOUNTING_HOLE]  85.72,123.83 0 top
Q1  MMBT2907  [SOT23-BEC]  60.83,87.63 90 bottom
R3  0, 1%  [R0402]  72.9,69.85 270 top
R4  0, 1%  [R0402]  71.88,69.85 270 top
R5  0  [R0402]  12.32,102.23 180 top
R6  100K, DNI  [R0402]  18.29,100.43 90 top
R8  1K  [R0402]  18.29,102.62 90 top
R10  0, 1%  [R0805]  12.7,97.59 0 top
R11  0  [R0402]  12.32,103.25 0 top
R12  1.5K, 1%  [R0402]  49.53,60.58 270 top
R13  1.5K, 1%  [R0402]  50.55,60.58 270 top
R15  40.2K  [R0402]  63.4,89.53 90 bottom
R18  4.75K, 1%  [R0402]  80.52,97.16 180 top
R20  10K  [R0402]  62.36,89.53 270 bottom
R21  499  [R0402]  60.71,90.17 180 bottom
R22  4.75K, 1%  [R0402]  83.44,97.16 0 top
R25  0, 1%  [R0402]  59.31,69.85 90 top
R26  1.5K, 1%  [R0402]  7.11,93.22 0 top
R27  100K, 1%  [R0402]  47.5,67.56 270 top
R28  0, 1%  [R0402]  80.52,76.83 0 top
R29  0, 1%  [R0402]  80.52,78.87 0 top
R30  0, 1%  [R0402]  80.52,77.85 0 top
R31  22, 1%  [R0402]  80.52,79.88 0 top
R33  0, 1%  [R0402]  63.5,64.26 0 top
R34  .1, 0805  [R0805]  113.03,123.7 0 top
R35  1K  [RN0804]  2.79,100.33 270 top
R39  4.75K, 1%  [R0402]  84.58,66.42 180 top
R40  4.75K, 1%  [R0402]  84.58,64.39 0 top
R41  4.75K, 1%  [R0402]  84.58,65.41 0 top
R53  100K, 1%  [R0402]  80.52,96.14 180 top
R54  100K, 1%, DNI  [R0402]  80.52,95.12 180 top
R55  100K, 1%  [R0402]  80.52,94.11 180 top
R56  100K, 1%  [R0402]  80.52,93.09 180 top
R57  100K, 1%  [R0402]  80.52,92.08 180 top
R58  100K, 1%  [R0402]  80.52,91.06 180 top
R59  100K, 1%  [R0402]  80.52,90.04 180 top
R60  100K, 1%  [R0402]  80.52,89.03 180 top
R61  100K, 1%  [R0402]  80.52,88.01 180 top
R62  100K, 1%  [R0402]  80.52,87 180 top
R63  100K, 1%  [R0402]  80.52,85.98 180 top
R64  100K, 1%, DNI  [R0402]  80.52,84.96 180 top
R65  100K, 1%, DNI  [R0402]  80.52,83.95 180 top
R66  100K, 1%, DNI  [R0402]  80.52,82.93 180 top
R67  100K, 1%  [R0402]  80.52,81.92 180 top
R68  100K, 1%  [R0402]  80.52,80.9 180 top
R69  100, 1%  [R0402]  106.17,76.45 0 top
R70  100K, 1%, DNI  [R0402]  87.12,95.12 180 top
R71  100K, 1%  [R0402]  87.12,94.11 180 top
R72  100K, 1%, DNI  [R0402]  87.12,93.09 180 top
R73  100K, 1%, DNI  [R0402]  87.12,91.44 180 top
R74  100K, 1%, DNI  [R0402]  87.12,90.42 180 top
R75  100K, 1%, DNI  [R0402]  87.12,89.41 180 top
R76  100K, 1%, DNI  [R0402]  87.12,88.39 180 top
R77  100K, 1%, DNI  [R0402]  87.12,87.38 180 top
R78  100K, 1%, DNI  [R0402]  87.12,86.36 180 top
R79  100K, 1%, DNI  [R0402]  87.12,85.34 180 top
R80  100K, 1%, DNI  [R0402]  87.12,84.33 180 top
R81  100K, 1%  [R0402]  87.12,83.31 180 top
R82  100K, 1%  [R0402]  87.12,82.3 180 top
R83  100K, 1%  [R0402]  87.12,81.28 180 top
R84  100K, 1%, DNI  [R0402]  87.12,80.26 180 top
R85  100K, 1%, DNI  [R0402]  87.12,79.25 180 top
R86  10K, 1%  [R0402]  41.91,98.04 0 top
R87  10K, 1%  [R0402]  41.91,100.08 0 top
R88  10K, 1%  [R0402]  41.91,101.09 0 top
R89  10K, 1%  [R0402]  41.91,103.12 0 top
R90  10K, 1%  [R0402]  41.91,104.14 0 top
R91  10K, 1%  [R0402]  41.91,99.06 0 top
R92  10K, 1%  [R0402]  41.91,97.03 0 top
R163  100K, DNI  [R0402]  65.81,66.29 0 top
R164  1.5K, 1%  [R0402]  65.81,67.31 180 top
R168  10K  [R0402]  109.22,123.7 270 top
R169  1.5K, 1%  [R0402]  68.05,65.28 180 top
R170  1.5K, 1%  [R0402]  68.05,66.29 180 top
R171  10K  [R0402]  108.33,54.36 270 top
R172  10K  [R0402]  108.33,46.74 270 top
R173  10K  [R0402]  108.33,39.12 270 top
R174  10K  [R0402]  108.33,31.5 270 top
R175  10K  [R0402]  108.33,23.88 270 top
R181  B72520T0300K062  [CT/CN1206]  12.7,50.8 270 top
R182  B72520T0300K062  [CT/CN1206]  12.7,43.18 270 top
R183  B72520T0300K062  [CT/CN1206]  12.7,33.78 270 top
R184  B72520T0300K062  [CT/CN1206]  12.62,26.16 270 top
R185  B72520T0300K062  [CT/CN1206]  12.7,16.76 270 top
R186  B72520T0300K062  [CT/CN1206]  12.7,9.14 270 top
R211  80, 0.1%  [0309/12]  38.1,49.66 180 top
R212  10K, 1%  [R0805]  26.67,49.15 0 top
R213  2K, 1%  [R0805]  26.67,51.18 0 top
R214  10K, 1%  [R0805]  26.67,53.21 0 top
R221  80, 0.1%  [0309/12]  38.1,42.04 180 top
R222  10K, 1%  [R0805]  26.67,41.53 0 top
R223  2K, 1%  [R0805]  26.67,43.56 0 top
R224  10K, 1%  [R0805]  26.67,45.59 0 top
R231  80, 0.1%  [0309/12]  38.1,32.64 180 top
R232  10K, 1%  [R0805]  26.67,32.13 0 top
R233  2K, 1%  [R0805]  26.67,34.16 0 top
R234  10K, 1%  [R0805]  26.67,36.2 0 top
R241  80, 0.1%  [0309/12]  38.1,25.02 180 top
R242  10K, 1%  [R0805]  26.67,24.51 0 top
R243  2K, 1%  [R0805]  26.67,26.54 0 top
R244  10K, 1%  [R0805]  26.67,28.57 0 top
R251  80, 0.1%  [0309/12]  38.1,15.62 180 top
R252  10K, 1%  [R0805]  26.67,15.11 0 top
R253  2K, 1%  [R0805]  26.67,17.14 0 top
R254  10K, 1%  [R0805]  26.67,19.18 0 top
R261  80, 0.1%  [0309/12]  38.1,8 180 top
R262  10K, 1%  [R0805]  26.67,7.49 0 top
R263  2K, 1%  [R0805]  26.67,9.53 0 top
R264  10K, 1%  [R0805]  26.67,11.56 0 top
R281  10K  [RN0804]  102.23,88.65 0 top
R282  10K  [RN0804]  102.23,100.84 180 top
R291  10K  [RN0804]  102.23,76.45 0 top
R301  1K  [R0402]  17.27,69.09 90 top
R302  1K  [R0402]  16.26,69.09 90 top
R303  1K, DNI  [R0402]  18.29,62.87 270 top
R304  1K, DNI  [R0402]  15.24,69.09 270 top
R305  150, 1%  [R0805]  16.56,64.77 90 top
R401  1K  [R0402]  17.53,107.31 90 top
R402  1K  [R0402]  22.1,107.31 90 top
R801  1K  [R0402]  97.03,3.81 90 top
R802  1K  [R0402]  99.06,3.81 90 top
RTC1  DS3231MZ+  [SO08]  66.93,71.12 270 top
S1  KMR231GLFS  [SW4SMD_63X161LS]  5.84,106.17 0 top
S2  KMR231GLFS  [SW4SMD_63X161LS]  13.21,106.17 0 top
S11  [P101]  114.81,92.71 180 top
S12  [P101]  114.81,103.5 180 top
S13  [DS-04]  114.81,81.03 90 top
T4  DA2304-AL  [DA230X-AL]  27.94,113.03 90 top
TP1  TPB0,65  [TP_B0,65]  57.15,81.28 0 bottom
TP2  TPB0,65  [TP_B0,65]  58.42,81.28 0 bottom
TP3  TPB0,65  [TP_B0,65]  62.23,81.28 0 bottom
TP4  TPB0,65  [TP_B0,65]  63.5,81.28 0 bottom
TP5  TESTPAD/W_HOLE_1X1  [TESTPAD/W_HOLE_1X1]  91.44,102.87 270 top
TP6  TESTPAD/W_HOLE_1X1  [TESTPAD/W_HOLE_1X1]  91.44,105.41 270 top
TP7  TESTPAD/W_HOLE_1X1  [TESTPAD/W_HOLE_1X1]  93.98,102.87 270 top
TP8  TESTPAD/W_HOLE_1X1  [TESTPAD/W_HOLE_1X1]  93.98,105.41 270 top
TP9  TESTPAD/W_HOLE_1X1  [TESTPAD/W_HOLE_1X1]  35.56,62.23 90 top
TP10  TESTPAD/W_HOLE_1X1  [TESTPAD/W_HOLE_1X1]  35.56,59.69 90 top
TP11  TPB0,65  [TP_B0,65]  68.58,92.71 0 bottom
TP12  TPB0,65  [TP_B0,65]  68.58,90.17 0 bottom
TP13  TPB0,65  [TP_B0,65]  63.5,96.52 0 bottom
TP14  TPB0,65  [TP_B0,65]  67.31,87.63 0 bottom
TP15  TPB0,65  [TP_B0,65]  59.69,85.09 0 bottom
TP16  TPB0,65  [TP_B0,65]  58.42,87.63 0 bottom
TP17  TESTPAD/W_HOLE_1X1  [TESTPAD/W_HOLE_1X1]  52.58,62.23 0 top
TP18  TESTPAD/W_HOLE_1X1  [TESTPAD/W_HOLE_1X1]  52.58,59.69 0 top
TP19  TESTPAD/W_HOLE_1X1  [TESTPAD/W_HOLE_1X1]  66.67,63.5 0 top
TP20  TESTPAD/W_HOLE_1X1  [TESTPAD/W_HOLE_1X1]  66.67,60.96 0 top
TP21  TPB0,65  [TP_B0,65]  60.96,96.52 0 bottom
TP22  TPB0,65  [TP_B0,65]  64.77,96.52 0 bottom
TP23  TPB0,65  [TP_B0,65]  68.58,91.44 0 bottom
TP24  TPB0,65  [TP_B0,65]  68.58,88.9 0 bottom
TP26  TPB0,65  [TP_B0,65]  62.23,96.52 0 bottom
TP31  TPB0,65  [TP_B0,65]  19.81,101.09 0 bottom
TP32  TPB0,65  [TP_B0,65]  49.53,87.63 0 bottom
TP33  TPB0,65  [TP_B0,65]  69.85,93.98 0 bottom
U1  OSD3358-512M-ICB  [OSD335X-BGA-400]  60.96,88.9 270 top
U2  TPD4S012_DRY_6_P1_M  [DRY6]  10.41,100.2 180 top
U4  APX811-31UGSOT  [SOT143-R]  15.47,102.34 180 top
U5  TLVH431  [SOT23-3]  64.77,87.63 270 bottom
U6  SN74LVC2G241_DCU_8  [DCU8]  50.8,66.67 0 top
U16  AT97SC3205T-G3M4400B  [QFN32-0.4-4X4MM]  44.45,60.58 0 top
U27  LAN8710  [LAN8710A-QFN32]  35.56,79.38 0 top
U28  TCAN1051HV  [BEAGLEBONE_BLUE_D8]  72.39,5.84 0 top
U29  MAX3483EESA+T  [21-0041B_8]  24.13,64.77 180 top
U40  ISO3086TDW  [DW16]  45.72,113.03 90 top
U$1  [OSHW_8MM]  66.04,16.51 0 top
U$2  [XYZ-LABEL]  60.96,0.64 0 top
VREG1  LM2596S-5.0  [TO263-5]  73.15,116.84 0 top
VREG2  L7824CV  [78XXL]  85.72,112.65 0 top
VREG4  TPS76350  [DBV5]  36.7,118.49 0 top
X1  10118194-0001LF  [10118194-0001LF(MICRO-USB-B-AMPHENOL-FCI)]  1.45,100.33 180 bottom
X2  J0011D01BNL  [J0011D01BNL]  7.87,82.55 90 top
X3  MC4  [MC4]  8.13,63.75 270 top
X4  CTI-JTAG  [CTI-JTAG]  78.74,67.31 0 top
X5  DM3CS-SF  [DM3CS-SF]  24.13,95 270 top
X6  6p-2.54  [H6-2.54]  20.32,59.69 270 top
X7  TH-2X10  [H2X10-2.54]  92.71,88.9 0 top
X8  MC4  [MC4]  113.79,12.7 90 top
X10  MC4  [MC4]  8.13,46.74 270 top
X11  MC4  [MC4]  8.13,29.72 270 top
X12  MC4  [MC4]  8.13,12.7 270 top
X21  MC10  [MC10]  113.79,41.27 90 top
X24  MSTBA2  [MSTBA2]  116.84,115.57 90 top
X41  MSTBA3  [MSTBA3]  5.08,116.84 270 top
Y7  7A-25.000MAAE-T  [CRYSTAL-TXC-7A]  35.56,71.37 180 top

## Tracks (layer width: path | path; a pad name or v marks a point on that pad's centre or on a via)
1P8V_REF_1  (via drill 0.3)
  Top 0.305: v28.98,49.15 R212.2 | v28.98,41.53 R222.2 | v28.98,32.13 R232.2 | v28.98,24.51 R242.2 | v51.44,28.17 IC11.8 | v51.44,24.94 IC11.8 | v51.44,45.19 IC10.8 | v51.44,41.96 IC10.8 | IC10.8 56.26,43.58 58.8,41.04 IC14.1 57.56,24.49 | IC14.2 57.56,24.49 | 57.56,24.49 57.56,25.96 56.95,26.56 IC11.8
  Bottom 0.305: v51.44,41.96 49.84,43.56 31.01,43.56 v28.98,41.53 | v28.98,49.15 30.5,47.62 50.16,47.62 51.44,46.35 v51.44,45.19 | v28.98,32.13 30.5,30.61 50.16,30.61 51.44,29.34 v51.44,28.17 | v28.98,24.51 31.01,26.54 49.84,26.54 v51.44,24.94
1P8V_REF_2  (via drill 0.3)
  Top 0.305: R262.2 v28.98,7.49 | v51.44,11.15 IC12.8 51.44,9.53 | v51.44,7.92 51.44,9.53 | IC14.6 IC14.7 57.53,12.06 54.99,9.53 51.44,9.53 | v28.98,15.11 R252.2
  Bottom 0.305: v28.98,7.49 31.01,9.53 49.84,9.53 v51.44,7.92 | v28.98,15.11 30.5,13.59 50.16,13.59 51.44,12.32 v51.44,11.15
5V_OUT
  pour Top (rank 2): 72.06,113.18 72.06,108.48 71.78,108.2 65.51,108.2 65.1,107.8 65.1,106.68 64.85,106.43 60.96,106.43 60.71,106.68 60.71,122.94 60.96,123.19 66.8,123.19 67.06,122.94 67.06,113.79 67.31,113.54 71.7,113.54
24VAC
  pour Top: 108.71,106.43 108.94,106.43 109.19,106.68 109.19,109.22 108.94,109.47 106.76,109.47 106.12,108.84 106.12,106.43 105.41,106.43 105.16,106.17 105.16,102.57 105.41,102.31 108.46,102.31 108.71,102.57
24VAC_IN  (via drill 0.3)
  Bottom 1.27: F1.P$1 107.7,113.03 X24.1
  other vias: 114.81,62.99 115.82,62.99 116.84,62.99 114.81,61.98 115.82,61.98 116.84,61.98 114.81,60.96 115.82,60.96 116.84,60.96
  pour Top: 117.09,64.01 114.05,64.01 113.79,63.75 113.79,60.2 114.05,59.94 119.25,59.94 119.89,60.58 119.89,74.42 118.62,75.69 116.84,75.69 115.57,76.96 115.57,113.79 114.3,115.06 109.52,115.06 108.89,114.43 108.89,111.63 109.52,111 112.04,111 114.05,108.99 114.05,75.44 115.32,74.17 117.09,74.17 118.36,72.9 118.36,65.28
  pour Bottom (isolate 0.406): 107.37,59.94 117.22,59.94 117.47,60.2 117.47,63.75 117.22,64.01 114.05,64.01 113.79,63.75 113.79,63.37 111.89,61.47 106.43,61.47 103.63,58.67 55.02,58.67 53.11,56.77 12.27,56.77 11,58.04 11,59.05 10.36,59.69 6.35,59.69 5.71,59.05 5.71,55.88 6.35,55.24 53.92,55.24 55.83,57.15 104.57,57.15
24VDC_AUX  (via drill 0.3)
  Top 0.203: VREG2.OUT 94.49,108.84 95.76,110.11 95.76,124.33 97.03,125.6 D19.1
  Top 0.254: K1.1 101.98,55.53
  Top 0.305: K2.1 80.52,54.1 100.55,54.1 101.98,55.53 | K4.1 80.52,37.59 100.52,37.59 K3.1 107.76,44.83 109.84,44.83 | K5.1 105.11,22.51 106.38,23.78 106.38,28.32 107.64,29.59 109.84,29.59
  Top 0.508: VREG2.OUT C106.1
  other vias: 95.89,63.37 96.9,63.37 94.87,63.37 102.62,63.75 101.6,63.75 102.62,62.74 101.6,62.74
  pour Top: 97.54,64.21 97.54,63.25 97.28,62.99 94.36,62.99 94.11,63.25 94.11,64.21 94.36,64.47 97.28,64.47
  pour Bottom: 97.41,102.87 99.57,102.87 99.82,102.62 99.82,99.06 99.57,98.81 97.54,98.81 97.28,98.55 97.28,65.53 98.55,64.26 102.87,64.26 103.12,64.01 103.12,61.72 102.87,61.47 94.36,61.47 94.11,61.72 94.11,64.21 95.25,65.35 95.25,105.41 93.98,106.68 87.17,106.68 86.92,106.93 86.92,110.49 87.17,110.74 94.28,110.74 97.16,107.87 97.16,103.12
  pour Top: 100.08,56.31 100.08,54.48 100.71,53.85 103,53.85 103.63,54.48 103.63,58.67 103.89,58.93 109.35,58.93 109.6,58.67 109.6,17.14 110.24,16.51 116.2,16.51 116.84,17.14 116.84,19.68 116.2,20.32 111.89,20.32 111.25,20.95 111.25,60.83 110.62,61.47 103.38,61.47 103.12,61.72 103.12,64.01 102.87,64.26 101.45,64.26 101.19,64.01 101.19,57.43
24VDC_UNREG  (via drill 0.3)
  other vias: 68.58,110.49 68.58,111.51 68.58,109.47 97.03,113.92 97.03,112.9 98.04,112.9 98.04,113.92 98.04,114.94 97.03,114.94 67.56,111.51 66.55,111.51
  pour Top: 65.91,109.19 70.1,109.19 70.36,109.45 70.36,112.14 65.91,112.14 65.66,111.89 65.66,109.45
  pour Bottom: 65.91,109.19 81.53,109.19 81.79,109.45 81.79,110.87 83.19,112.27 104.34,112.27 104.6,112.52 104.6,115.95 104.34,116.2 79.63,116.2 79.25,115.82 79.25,113.79 78.99,113.54 65.91,113.54 65.66,113.28 65.66,109.45
  pour Top (isolate 0.305): 104.6,102.57 104.6,115.95 104.34,116.2 96.52,116.2 96.27,115.95 96.27,102.57 96.52,102.31 104.34,102.31
41_A
  Bottom 1.27: X41.1 13.16,121.92 14.43,123.19 GDT1.2
  pour Top (rank 3): 23.34,122.43 18.75,122.43 18.49,122.17 18.49,121.54 18.24,121.28 13.59,121.28 13.34,121.54 13.34,126.11 13.59,126.36 23.34,126.36 23.6,126.11 23.6,122.68
41_B
  Bottom 1.27: X41.2 13.16,116.84 14.43,115.57 GDT1.1
  pour Top: 16.51,109.73 16.51,113.79 17.32,114.6 18.24,114.6 18.49,114.86 18.49,117.22 18.24,117.47 13.59,117.47 13.34,117.22 13.34,109.73 13.59,109.47 16.26,109.47
485_A
  Top 0.152: R304.2 15.24,67.77 16.51,66.5 16.51,65.66
  Top 0.254: 12.34,64.72 D305.1 | R305.2 16.51,65.66
  Top 0.305: X3.2 10.57,65.66 11.51,64.72 12.34,64.72 14.45,64.72 15.39,65.66 16.51,65.66 | U29.6 16.82,65.41 R305.2
485_B
  Top 0.152: R303.1 17.02,63.42 R305.1
  Top 0.254: 12.32,62.81 D305.2 12.35,62.81
  Top 0.305: X3.3 10.54,61.85 11.51,62.81 12.32,62.81 | U29.7 16.82,64.14 R305.1 15.49,62.81 12.35,62.81
AGND  (via drill 0.3)
  Top 0.152: v59.66,73.15 59.31,72.8 R25.2
  Top 0.254: C9.2 C8.2 v64.06,61.44 | v62.94,66.06 C10.2
  Top 0.305: R213.2 32.64,51.18 33.91,52.45 C111.2 43.18,53.21 44.45,51.94 R211.1 | R223.2 32.64,43.56 33.91,44.83 C121.2 43.13,45.59 44.4,44.32 44.4,42.09 R221.1 | R233.2 32.64,34.16 33.91,35.43 C131.2 43.18,36.2 44.45,34.92 R231.1 | R243.2 32.64,26.54 33.91,27.81 C141.2 43.18,28.57 44.45,27.3 R241.1 | R253.2 32.64,17.14 33.91,18.41 C151.2 43.18,19.18 44.45,17.91 R251.1 | R263.2 32.64,9.53 33.91,10.79 C161.2 43.18,11.56 44.45,10.29 R261.1 | v47.62,17.48 47.62,15.86 IC12.4 | v47.62,34.49 47.62,32.88 IC11.4 | v47.62,51.51 IC10.4 | v55.02,22.89 55.02,24.48 IC14.4
  Top 0.508: v59.66,74.68 59.05,75.29 U1.Y9 | X10.4 12.19,41.02 R182.2 | X10.2 12.19,48.64 R181.2 | X11.2 12.19,31.62 R183.2 | X11.4 12.12,24 R184.2 | X12.2 12.19,14.61 R185.2 | X12.4 12.19,6.99 R186.2
  other vias: 59.11,73.91
  pour Top: 59.87,75.18 59.87,72.64 58.9,72.64 58.9,75.18
  pour Route2: 58.12,61.77 58.12,78.74 58.75,79.38 62.87,79.38 63.5,78.74 63.5,67.49 64.77,66.22 64.77,5.08 64.14,4.45 42.16,4.45 41.91,4.7 41.91,5.08 39.27,7.72 33.1,7.72 30.48,5.11 30.48,4.7 30.23,4.45 6.35,4.45 5.71,5.08 5.71,54.61 6.35,55.24 51.59,55.24
AIN1  (via drill 0.3)
  Top 0.152: U1.W10 59.84,77.62 59.84,76.1 60.5,75.44 60.5,52.12 v60.2,51.82
  Top 0.305: IC10.2 IC10.1 v51.44,51.51
  Bottom 0.152: v60.2,51.82 51.74,51.82 v51.44,51.51
AIN2  (via drill 0.3)
  Top 0.152: U1.V10 59.54,78.59 59.54,75.97 60.2,75.31 60.2,52.68 59.44,51.92 v59.44,50.8
  Top 0.305: IC10.6 IC10.7 v50.16,45.19
  Bottom 0.152: v59.44,50.8 58.17,50.8 56.9,49.53 56.9,44.86 55.63,43.59 51.77,43.59 v50.16,45.19
AIN3  (via drill 0.3)
  Top 0.152: U1.V9 58.27,78.59 58.27,68.05 59.89,66.42 59.89,53.24 58.67,52.02 v58.67,49.78
  Top 0.305: IC11.2 51.41,32.87 | 51.41,32.87 IC11.1 | v51.44,34.49 51.44,32.9 51.41,32.87
  Bottom 0.152: v58.67,49.78 58.67,38.51 57.4,37.24 54.18,37.24 v51.44,34.49
AIN4  (via drill 0.3)
  Top 0.152: U1.Y11 61.59,27.56 v61.72,27.43
  Top 0.305: IC11.6 IC11.7 v50.16,28.17
  Bottom 0.152: v50.16,28.17 51.77,26.57 60.86,26.57 v61.72,27.43
AIN5  (via drill 0.3)
  Top 0.152: U1.W11 61.11,77.62 61.11,27.03 v61.72,26.42
  Top 0.305: IC12.2 IC12.1 v51.44,17.48
  Bottom 0.152: v61.72,26.42 60.83,25.53 60.83,22.61 59.56,21.34 55.3,21.34 v51.44,17.48
AIN6  (via drill 0.3)
  Top 0.152: U1.V11 60.81,78.59 60.81,26.31 v61.72,25.4
  Top 0.305: IC12.6 IC12.7 v50.16,11.15
  Bottom 0.152: v61.72,25.4 61.72,10.79 60.45,9.53 51.79,9.53 v50.16,11.15
AIN7
  Top 0.152: U1.U12 U1.V12
B03_NO
  Bottom 1.27: X21.6 109.6,43.18 102.13,35.71 93.06,35.71 K3.NO
B_UART0_RX
  Top 0.152: U6.2 47.57,66.93 R27.2 47.42,66.93 30.48,66.93 29.21,65.66 29.21,59.69 27.94,58.42 20.32,58.42 X6.4
B_UART0_TX
  Top 0.152: U6.3 30.99,66.42 29.72,65.15 29.72,59.18 28.45,57.91 18.29,57.91 X6.5
BAT_SENSE
  Top 0.152: U1.E19 72.54,96.67 77.06,96.67 79.12,98.73 86.39,98.73 86.94,99.29 86.94,102.56 87.58,103.2 89.23,103.2 TP6.P$1
BO1_C
  Bottom 1.27: X21.9 109.6,54.61 104.52,49.53 K1.C
BO1_NO
  Bottom 1.27: X21.10 109.6,58.42 103.63,52.45 92.83,52.45 K1.NO
BO2_C
  Bottom 1.27: X21.7 109.6,46.99 103.89,41.27 89.34,41.27 K2.C
BO2_NO
  Bottom 1.27: X21.8 109.7,50.8 105.51,46.61 91.62,46.61 85.72,52.5 69.92,52.5 K2.NO
BO3_C
  Bottom 1.27: X21.5 109.78,39.37 103.95,33.54 K3.C
BO4_C
  Bottom 1.27: X21.3 110.26,31.75 103.28,24.77 89.34,24.77 K4.C
BO4_NO
  Bottom 1.27: X21.4 109.96,35.56 104.42,30.02 91.62,30.02 85.7,35.94 69.97,35.94 K4.NO
BO5_C
  Bottom 1.27: X21.1 111.14,24.13 103.95,16.94 K5.C
BO5_NO
  Bottom 1.27: X21.2 110.67,27.94 102.51,19.79 92.28,19.79 89.75,22.32 K5.NO
CAN1_RXD  (via drill 0.3)
  Top 0.152: U1.Y7 56.52,65.66 55.24,64.39 32,64.39 30.73,63.12 30.73,57.15 29.46,55.88 5.71,55.88 v5.08,55.24 | v68.43,3.94 U28.4 71.32,3.94 72.72,2.54 79.25,2.54 83.57,6.86 87.88,6.86 89.15,5.59 100.06,5.59 D802.1
  Bottom 0.152: v5.08,55.24 4.57,54.74 4.57,4.32 5.84,3.05 29.46,3.05 33.78,7.37 38.61,7.37 42.93,3.05 67.54,3.05 v68.43,3.94
CAN1_TXD  (via drill 0.3)
  Top 0.152: U1.W7 56.52,78.08 56.03,77.6 56.03,66.17 54.76,64.9 31.5,64.9 30.23,63.63 30.23,57.66 28.96,56.39 5.21,56.39 v4.06,55.24 | U28.1 v71.42,7.75 72.59,6.58 72.59,4.19 73.74,3.05 78.99,3.05 83.31,7.37 88.16,7.37 89.43,6.1 102.49,6.1 103.12,5.46 D801.1
  Bottom 0.152: v4.06,55.24 4.06,4.09 5.61,2.54 29.72,2.54 34.04,6.86 38.35,6.86 42.67,2.54 70.28,2.54 71.42,3.68 v71.42,7.75
CAN_H
  Top 0.305: U28.7 79.2,6.48 81.74,9.02 106.6,9.02 107.43,9.84 D805.2 112.84,9.84 X8.2
CAN_L
  Top 0.305: U28.6 79.45,5.21 82.25,8 110.16,8 D805.1 112.84,7.94 X8.1
CGND  (via drill 0.3)
  Top 0.305: v36.83,94.44 36.83,93.45 X5.11 | v36.83,99.47 X5.13
  Bottom 0.305: v36.83,99.47 v36.83,94.44
  Bottom 0.813: X2.S2 22.25,90.42 v22.81,90.98
  other vias: 22.81,91.9
  pour Top: 5.71,57.15 -5.08,57.15 -5.08,-5.08 127,-5.08 127,57.15 120.65,57.15 120.65,5.08 120.02,4.45 113.67,4.45 113.03,3.81 113.03,1.27 112.39,0.64 89.56,0.64 88.93,1.27 88.93,5.08 87.66,6.35 83.82,6.35 82.55,5.08 82.55,1.27 81.92,0.64 40.01,0.64 39.37,1.27 39.37,5.08 38.1,6.35 34.29,6.35 33.02,5.08 33.02,1.27 32.38,0.64 15.24,0.64 14.61,1.27 14.61,3.81 13.97,4.45 6.35,4.45 5.71,5.08
  pour Bottom (rank 6): -1.27,57.15 5.71,57.15 5.71,72.14 6.35,72.77 11.56,72.77 12.83,74.04 12.83,75.31 11.56,76.58 10.64,76.58 8.86,74.8 6.91,74.8 5.71,76 5.71,97.46 5.08,98.09 3.05,98.09 3.05,102.54 5.08,102.54 5.71,103.17 5.71,125.73 6.35,126.36 32.38,126.36 33.02,125.73 33.02,121.92 34.29,120.65 38.1,120.65 39.37,121.92 39.37,125.73 40.01,126.36 79.76,126.36 80.39,125.73 80.39,120.4 81.66,119.13 89.79,119.13 91.06,120.4 91.06,125.73 91.69,126.36 112.39,126.36 113.03,125.73 113.03,120.02 115.57,117.47 120.02,117.47 120.65,116.84 120.65,57.15 123.19,57.15 123.19,128.27 -1.27,128.27
  pour Bottom (rank 6): 5.71,57.15 -1.27,57.15 -1.27,-1.27 123.19,-1.27 123.19,57.15 120.65,57.15 120.65,5.08 120.02,4.45 113.67,4.45 113.03,3.81 113.03,1.27 112.39,0.64 89.56,0.64 88.93,1.27 88.93,5.08 87.66,6.35 83.82,6.35 82.55,5.08 82.55,1.27 81.92,0.64 40.01,0.64 39.37,1.27 39.37,5.08 38.1,6.35 34.29,6.35 33.02,5.08 33.02,1.27 32.38,0.64 6.53,0.64 3.05,4.37 3.05,55.24 3.68,55.88 5.08,55.88 5.71,56.52
  pour Top: -5.08,57.15 5.71,57.15 5.71,62.87 5.08,63.5 1.91,63.5 1.27,64.14 1.27,89.66 1.91,90.3 8.86,90.3 10.64,88.52 11.56,88.52 12.83,89.79 12.83,91.06 11.56,92.33 1.91,92.33 1.27,92.96 1.27,125.73 1.91,126.36 32.38,126.36 33.02,125.73 33.02,121.92 34.29,120.65 38.1,120.65 39.37,121.92 39.37,125.73 40.01,126.36 81.92,126.36 82.55,125.73 82.55,121.92 83.82,120.65 87.63,120.65 88.9,121.92 88.9,125.73 89.53,126.36 112.39,126.36 113.03,125.73 113.03,120.02 115.57,117.47 120.02,117.47 120.65,116.84 120.65,57.15 127,57.15 127,132.08 -5.08,132.08
  pour Top: 22.86,94.26 22.86,103.38 23.11,103.63 26.16,103.63 26.42,103.89 26.42,105.51 26.16,105.77 21.08,105.77 20.83,105.51 20.83,90.42 21.08,90.17 26.16,90.17 26.42,90.42 26.42,91.95 26.67,92.2 37.85,92.2 38.1,92.46 38.1,93.75 37.85,94.01 23.11,94.01
  pour Bottom: 20.83,91.95 20.83,90.42 21.08,90.17 23.62,90.17 23.88,90.42 23.88,91.95 23.62,92.2 21.08,92.2
CLKOUT2
  Top 0.152: X4.18 79.2,62.87 78.56,63.5 74.24,63.5 73.61,64.14 72.9,64.14 | 72.9,64.14 C2.2 | R3.2 72.9,64.14
CRS
  Top 0.152: ER124.1 43.1,80.72 39.85,80.72 39.26,80.13 U27.14
E_LED_GRN  (via drill 0.3)
  Top 0.152: X2.9 2.31,88.88 1.68,88.24 1.68,72.36 2.95,71.09 30.38,71.09 31.27,71.98 31.27,73.53 v32.23,74.5 | U27.3 34.81,76.01 v34.77,75.97
  Bottom 0.152: v32.23,74.5 32.38,74.65 33.96,74.65 34.77,75.46 v34.77,75.97
E_LED_YEL  (via drill 0.3)
  Top 0.152: X2.12 4.56,73.81 5.19,73.18 28.17,73.18 ER120.2 29.18,74.19 31.04,74.19 v31.34,74.5 | U27.2 34.31,76.3 34.09,76.07 v34.09,75.62
  Bottom 0.152: v31.34,74.5 31.9,75.06 33.53,75.06 v34.09,75.62
EEPROM_WP  (via drill 0.3)
  Top 0.152: U1.M2 49.53,87.63 48.56,87.63 48.06,88.14 35.26,88.14 32.51,85.39 32.51,81.92 v32.28,81.69
  Bottom 0.152: v32.28,81.69 31.29,81.69 30.02,80.42 30.02,71.86 31.39,70.48 50.16,70.48 J1.1
EHRPWM1A  (via drill 0.3)
  Top 0.152: U1.C13 v64.77,99.06 | v84.58,71.75 84.58,69.14 86.72,67 86.72,61.42 85.45,60.15 72.64,60.15 71.02,58.52 71.02,15.27 72.29,13.99 74.91,13.99 J4.1
  Bottom 0.152: v64.77,99.06 64.77,98.27 65.68,97.36 69.27,97.36 71.81,94.82 71.81,90.5 75.39,86.92 75.39,74.22 76.91,72.69 83.64,72.69 v84.58,71.75
EHRPWM1B  (via drill 0.3)
  Top 0.152: U1.A12 v63.5,101.6
EHRPWM2A  (via drill 0.3)
  Top 0.152: U1.A17 v69.85,101.6 | v82.93,74.78 83.19,74.78 85.45,72.52 85.45,69.85 87.02,68.28 87.02,61.27 85.6,59.84 72.77,59.84 71.32,58.4 71.32,17.78 72.59,16.51 J5.1
  Bottom 0.152: v69.85,101.6 69.85,99.39 73.64,95.61 73.64,91.26 77.22,87.68 77.22,75.41 77.85,74.78 v82.93,74.78
EHRPWM2B  (via drill 0.3)
  Top 0.152: v68.58,99.11 67.94,98.48 U1.C16 | v84.3,74.5 84.76,74.5 86.06,73.2 86.06,70.81 87.33,69.55 87.33,61.14 85.72,59.54 72.9,59.54 71.63,58.27 71.63,20.32 72.9,19.05 J6.1
  Bottom 0.152: v68.58,99.11 68.81,98.88 69.93,98.88 73.33,95.48 73.33,91.14 76.91,87.55 76.91,74.85 77.55,74.22 84.02,74.22 v84.3,74.5
GND  (via drill 0.3, 0.3 pad 0.61)
  Top 0.152: U16.24 46.91,61.98 v47.12,61.77 46.92,61.58 U16.23 | U16.18 46.93,59.58 v47.12,59.77 46.9,59.98 U16.19 | U16.20 46.92,60.38 v47.12,60.58 46.92,60.78 U16.21 | U16.32 43.05,62.79 42.8,63.04 v42.52,63.04 | C22.2 40.21,102.11 38.79,103.53 35.81,103.53 32.33,100.05 26.19,100.05 v25.91,100.33 | VREG1.6 v73.15,118.87 | v41.02,58.8 41.17,58.65 43.02,58.65 U16.9 | U16.5 41.99,60.38 v41.78,60.17 41.98,59.98 U16.6 | v41.78,61.72 41.93,61.58 U16.2 | v34.54,79.38 U27.33
  Top 0.203: U1.W13 64.77,77.47 64.77,75.34 67.18,72.92 67.18,69.85 67.82,69.22 RTC1.5
  Top 0.254: v40.51,75.92 ER103.2 | v40.51,74.85 ER102.2 | v40.51,73.79 ER104.2 | EC34.2 v43.31,79.12 | ER101.2 v40.51,80.19 | ER128.1 v27.81,74.68 | v24.26,75.69 EC36.2 | v24.26,77.47 EC37.2 | v24.26,78.49 EC38.2 | v24.26,80.26 EC39.2 | v30.61,73.66 ER120.1 ER115.1 ER117.1 | ER129.2 v40.51,84.45 | v24.26,81.28 EC40.2 | EC41.2 v31.93,69.09 | EC42.2 v39.19,69.09 | EC35.2 EC33.2 v38.89,73.74 | v32.23,73.74 EC31.2 | U1.Y1 v48.26,76.2 | U1.A1 v48.26,101.6 | U1.Y20 v73.66,76.2 | U1.A20 v73.66,101.6 | U6.4 50.24,65.93 50.49,66.18 50.49,67.17 50.24,67.42 U6.1 49.33,67.79 v49.45,67.92 | C6.1 v49.45,67.92 | IC4.15 v105.41,93.32 | IC4.8 v97.79,96.16 | v97.79,83.97 IC5.8 | IC5.6 IC5.5 IC5.4 IC5.3 v104.14,83.97 | v105.41,81.13 IC5.15 | R68.1 R67.1 R66.1 R65.1 R64.1 R63.1 R62.1 R61.1 R60.1 R59.1 R58.1 R57.1 R56.1 R55.1 R54.1 R53.1 R18.1 v81.92,97.16 | v79.5,71.75 X4.4 | v79.5,67.94 X4.10 | v79.5,64.14 X4.16 | v79.5,61.59 X4.20 | v69.98,64.14 C2.1 | v69.98,62.87 C1.1 | X4.8 X4.10 | X4.12 X4.10 | v10.19,106.96 11.14,106.96 S2.3 S2.1 | v85.98,63.37 C14.2 C15.2 | v85.98,66.42 R39.1 | S1.4 S1.2 7.91,105.39 v8.87,105.39 | U2.4 10.04,101.48 v10.41,101.85 | v16.05,98.65 C3.2 | v39.62,105.74 39.9,105.46 C21.2 | v17.27,103.38 16.26,103.38 U4.1 | v18.29,99.03 R6.1 | v40.39,61.98 40.26,61.85 C87.2 | v48.51,59.18 C85.2 | VREG1.5 76.56,115.47 v76.2,115.82 | EC30.2 v27.81,81.28 | v49.45,67.92 49.25,68.12 R27.1 | v20.09,66.67 U29.5 | v14.45,69.65 R304.1 R302.2 R301.2 | v20.09,63.42 C301.2 | v8.51,93.22 R26.2 | v2.29,98.3 R35.4 R35.3 R35.2 R35.1 v2.29,102.36 | v16.74,107.87 R401.2 | v22.89,107.87 R402.2 | v100.58,75.95 R291.1 R291.2 R291.3 R291.4 | v100.58,101.35 R282.4 R282.3 R282.2 R282.1 | v100.58,88.14 101.43,88.14 R281.1 R281.2 R281.3 R281.4
  Top 0.254: v99.06,81.13 IC5.10 | U28.2 v68.43,6.48 66.88,6.48 C801.2 | R801.2 v98.04,4.37 R802.2 | C104.2 v69.44,67.31 69.75,67.61 69.75,69.2 RTC1.5
  Top 0.305: C401.2 43.81,106.5 U40.3 v43.81,110.24 | v13.46,63.75 D305.3 | v109.22,8.89 D805.3
  Top 0.381: C79.2 C88.2 C87.2
  Top 0.508: X5.6 25.74,100.5 v25.91,100.33
  Top 0.813: v73.15,115.82 VREG1.3 v73.15,107.44
  other vias: 9.65,103.38 90.68,63.37 38.61,108.33 38.61,109.09 10.41,102.62 28.32,87.76 29.08,87.76 68.58,96.52 67.31,96.52 68.58,95.25 68.58,93.98 67.31,86.36 68.58,86.36 67.31,81.03 68.58,81.03 53.34,81.28 53.34,82.55 54.61,82.55 55.88,82.55 54.61,83.82 55.88,83.82 57.15,83.82 58.42,83.82 54.61,85.09 53.59,85.09 53.59,86.36 53.59,87.63 53.59,88.9 54.61,88.9 53.59,90.17 53.59,91.44 58.42,89.03 53.34,96.52 54.61,96.39 55.88,96.39 57.15,96.39 60.96,95.25 88.65,63.37 89.66,63.37 53.85,109.73 53.85,108.71 53.85,110.74 52.07,125.09 52.07,124.08 68.58,107.44 68.58,106.43 34.54,78.36 35.56,78.36 74.17,115.82 75.18,115.82 72.14,115.82 70.1,115.82 71.12,115.82 76.2,116.84 74.17,116.84 75.18,116.84 72.14,116.84 73.15,116.84 70.1,116.84 71.12,116.84 76.2,117.86 74.17,117.86 75.18,117.86 72.14,117.86 73.15,117.86 70.1,117.86 71.12,117.86 76.2,118.87 74.17,118.87 75.18,118.87 72.14,118.87 70.1,118.87 71.12,118.87 76.2,119.89 74.17,119.89 75.18,119.89 72.14,119.89 73.15,119.89 70.1,119.89 71.12,119.89 76.2,120.9 74.17,120.9 75.18,120.9 72.14,120.9 73.15,120.9 70.1,120.9 71.12,120.9 76.2,121.92 74.17,121.92 75.18,121.92 72.14,121.92 73.15,121.92 70.1,121.92 71.12,121.92 34.54,80.39 35.56,80.39 36.58,80.39 36.58,79.38 36.58,78.36 82.55,101.98 82.55,99.95 82.55,100.97 60.96,94.11 63.5,83.82 64.77,83.82 66.04,83.82 67.28,83.82 67.26,82.55 66.04,82.55 73.15,106.43 10.41,103.38
  pour Route2 (rank 2): -3.81,130.81 125.73,130.81 125.73,-3.81 -3.81,-3.81
  pour Top: 29.69,86.16 29.69,87.88 29.44,88.14 27.97,88.14 27.71,87.88 27.71,86.16 27.97,85.9 29.44,85.9